# EAGLE schematic 320349C(Rev1)E7 (EAGLE 7.7.0)

## Sheet 1 of 9
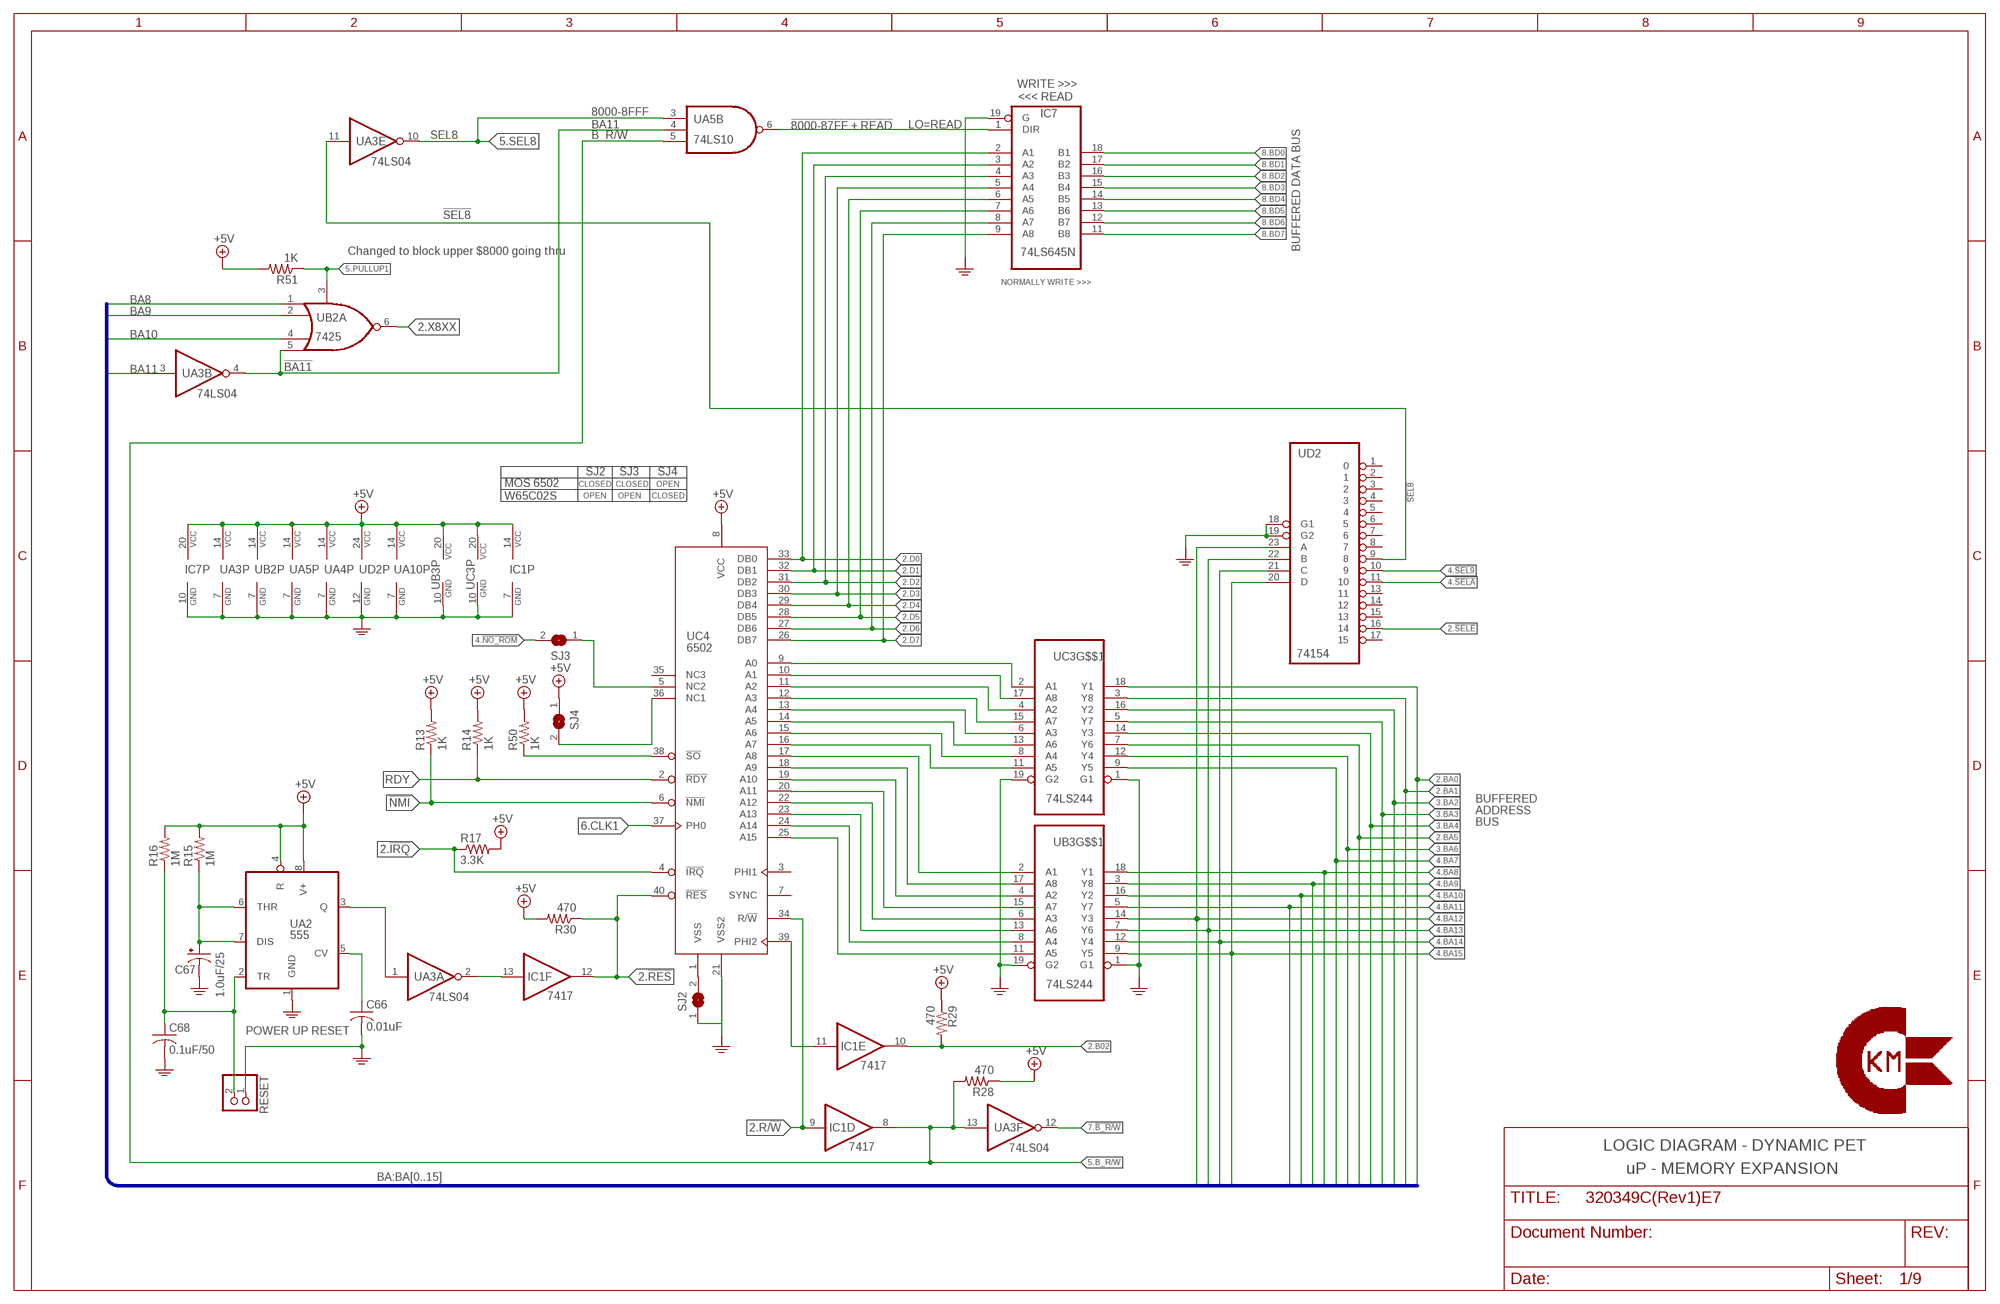
[diagram p0: schematic, sheet 1]

### Parts
C66  0.01uF  C-US025-025X050  [C025-025X050]
C67  1.0uF/25  CPOL-USE2.5-5  [E2,5-5]
C68  0.1uF/50  C-US025-025X050  [C025-025X050]
IC1  7417  7417N  [DIL14]
IC7  74LS645N  74645N  [DIL20]
R13  1K  R-US_0207/10  [0207/10]
R14  1K  R-US_0207/10  [0207/10]
R15  1M  R-US_0207/10  [0207/10]
R16  1M  R-US_0207/10  [0207/10]
R17  3.3K  R-US_0207/10  [0207/10]
R28  470  R-US_0207/10  [0207/10]
R29  470  R-US_0207/10  [0207/10]
R30  470  R-US_0207/10  [0207/10]
R50  1K  R-US_0207/10  [0207/10]
R51  1K  R-US_0207/10  [0207/10]
RESET  PINHD-1X2  [1X02]
SJ2  SJ  [SJ]
SJ3  SJ  [SJ]
SJ4  SJ  [SJ]
UA2  555  LM555N  [DIL08]
UA3  74LS04  74LS04N  [DIL14]
UA4  74LS00  74LS00N  [DIL14]
UA5  74LS10  74LS10N  [DIL14]
UA10  7417  7417N  [DIL14]
UB2  7425  7425N  [DIL14]
UB3  74LS244  74LS244B  [DIL20]
UC3  74LS244  74LS244B  [DIL20]
UC4  6502  [DIP40]
UD2  74154  74154N  [DIL24-6]

### Nets
!B_R/W: UA3.12(F:O) ; also sheet 7
!BA11: UA3.4(B:O) UA5.4(B:I1) UB2.5(A:I3) ; also sheet 7
!IRQ: R17.1 UC4.4(!IRQ) ; also sheet 2,3
!NMI: R13.1 UC4.6(!NMI)
!NO_ROM: SJ3.2 ; also sheet 4
!RES: IC1.12(F:O) R30.1 UC4.40(!RES) ; also sheet 2,3
!SEL8: UA3.11(E:I) UD2.9 ; also sheet 4
!SEL9: UD2.10 ; also sheet 4,5
!SELA: UD2.11 ; also sheet 4,5
!SELE: UD2.16 ; also sheet 2,3,4
+5V: IC1.14(P:VCC) IC7.20(VCC) R13.2 R14.2 R15.2 R16.2 R17.2 R28.1 R29.1 R30.2 R50.2 R51.2 SJ4.1 UA2.4(R) UA2.8(V+) UA3.14(P:VCC) UA4.14(P:VCC) UA5.14(P:VCC) UA10.14(P:VCC) UB2.14(P:VCC) UB3.20(VCC) UC3.20(VCC) UC4.8(VCC) UD2.24(VCC) ; also sheet 2,3,4,5,6,7,8,9
AB0: UC3.2(A1) UC4.9(A0)
AB1: UC3.17(A8) UC4.10(A1)
AB2: UC3.4(A2) UC4.11(A2)
AB3: UC3.15(A7) UC4.12(A3)
AB4: UC3.6(A3) UC4.13(A4)
AB5: UC3.13(A6) UC4.14(A5)
AB6: UC3.8(A4) UC4.15(A6)
AB7: UC3.11(A5) UC4.16(A7)
AB8: UB3.2(A1) UC4.17(A8)
AB9: UB3.17(A8) UC4.18(A9)
AB10: UB3.4(A2) UC4.19(A10)
AB11: UB3.15(A7) UC4.20(A11)
AB12: UB3.6(A3) UC4.22(A12)
AB13: UB3.13(A6) UC4.23(A13)
AB14: UB3.8(A4) UC4.24(A14)
AB15: UB3.11(A5) UC4.25(A15)
B02: IC1.10(E:O) R29.2 ; also sheet 2,3,5,7
B_R/W: IC1.8(D:O) R28.2 UA3.13(F:I) UA5.5(B:I2) ; also sheet 5,7
BA0: UC3.18(Y1) ; also sheet 2,3,4,5,7
BA1: UC3.3(Y8) ; also sheet 2,3,4,5,7
BA2: UC3.16(Y2) ; also sheet 3,4,5,7
BA3: UC3.5(Y7) ; also sheet 3,4,5,7
BA4: UC3.14(Y3) ; also sheet 3,4,5,7
BA5: UC3.7(Y6) ; also sheet 2,4,5,7
BA6: UC3.12(Y4) ; also sheet 3,4,5,7
BA7: UC3.9(Y5) ; also sheet 4,5,7
BA8: UB2.1(A:I0) UB3.18(Y1) ; also sheet 4,5,7
BA9: UB2.2(A:I1) UB3.3(Y8) ; also sheet 4,5,7
BA10: UB2.4(A:I2) UB3.16(Y2) ; also sheet 4,5,7
BA11: UA3.3(B:I) UB3.5(Y7) ; also sheet 4,5
BA12: UB3.14(Y3) UD2.23(A) ; also sheet 4,5
BA13: UB3.7(Y6) UD2.22(B) ; also sheet 4,5
BA14: UB3.12(Y4) UD2.21(C) ; also sheet 4,5
BA15: UB3.9(Y5) UD2.20(D) ; also sheet 4,5
BD0: IC7.18(B1) ; also sheet 8
BD1: IC7.17(B2) ; also sheet 8
BD2: IC7.16(B3) ; also sheet 8
BD3: IC7.15(B4) ; also sheet 8
BD4: IC7.14(B5) ; also sheet 8
BD5: IC7.13(B6) ; also sheet 8
BD6: IC7.12(B7) ; also sheet 8
BD7: IC7.11(B8) ; also sheet 8
CLK1: UC4.37(PH0) ; also sheet 6,7
CLK2: IC1.11(E:I) UC4.39(PHI2)
D0: IC7.2(A1) UC4.33(DB0) ; also sheet 2,3,4,5
D1: IC7.3(A2) UC4.32(DB1) ; also sheet 2,3,4,5
D2: IC7.4(A3) UC4.31(DB2) ; also sheet 2,3,4,5
D3: IC7.5(A4) UC4.30(DB3) ; also sheet 2,3,4,5
D4: IC7.6(A5) UC4.29(DB4) ; also sheet 2,3,4,5
D5: IC7.7(A6) UC4.28(DB5) ; also sheet 2,3,4,5
D6: IC7.8(A7) UC4.27(DB6) ; also sheet 2,3,4,5
D7: IC7.9(A8) UC4.26(DB7) ; also sheet 2,3,4,5
GND: C66.2 C67.- C68.2 IC1.7(P:GND) IC7.10(GND) IC7.19(G) RESET.1 SJ2.1 UA2.1(GND) UA3.7(P:GND) UA4.7(P:GND) UA5.7(P:GND) UA10.7(P:GND) UB2.7(P:GND) UB3.1(G1) UB3.10(GND) UB3.19(G2) UC3.1(G1) UC3.10(GND) UC3.19(G2) UC4.21(VSS2) UD2.12(GND) UD2.18(G1) UD2.19(G2) ; also sheet 2,3,4,5,6,7,8,9
N$28: IC7.1(DIR) UA5.6(B:O)
N$32: R50.1 UC4.38(!SO)
N$33: C66.1 UA2.5(CV)
N$35: C67.+ R15.1 UA2.6(THR) UA2.7(DIS)
N$36: C68.1 R16.1 RESET.2 UA2.2(TR)
N$39: IC1.13(F:I) UA3.2(A:O)
N$40: UA2.3(Q) UA3.1(A:I)
N$85: SJ3.1 UC4.5(NC2)
N$91: SJ4.2 UC4.36(NC1)
N$95: SJ2.2 UC4.1(VSS)
PULLUP1: R51.1 UB2.3(A:G) ; also sheet 5
R/!W: IC1.9(D:I) UC4.34(R/!W) ; also sheet 2,3
RDY: R14.1 UC4.2(!RDY)
SEL8: UA3.10(E:O) UA5.3(B:I0) ; also sheet 5,7
X8XX: UB2.6(A:O) ; also sheet 2,3,4
Unconnected: UC4.3(PHI1) UC4.7(SYNC) UC4.35(NC3) UD2.1 UD2.2 UD2.3 UD2.4 UD2.5 UD2.6 UD2.7 UD2.8 UD2.13 UD2.14 UD2.15 UD2.17

### Buses
BA:BA[0..15]

### Notes on the sheet
- WRITE >>>
- <<< READ
- 8000-8FFF
- !8000-87FF + READ | LO=READ
- BUFFERED DATA BUS
- Changed to block upper $8000 going thru
- NORMALLY WRITE >>>
- SJ2 | SJ3 | SJ4
- MOS 6502 | CLOSED | CLOSED | OPEN
- W65C02S | OPEN | OPEN | CLOSED
- BUFFERED
- ADDRESS
- BUS
- POWER UP RESET
- LOGIC DIAGRAM - DYNAMIC PET
- uP - MEMORY EXPANSION

## Sheet 2 of 9
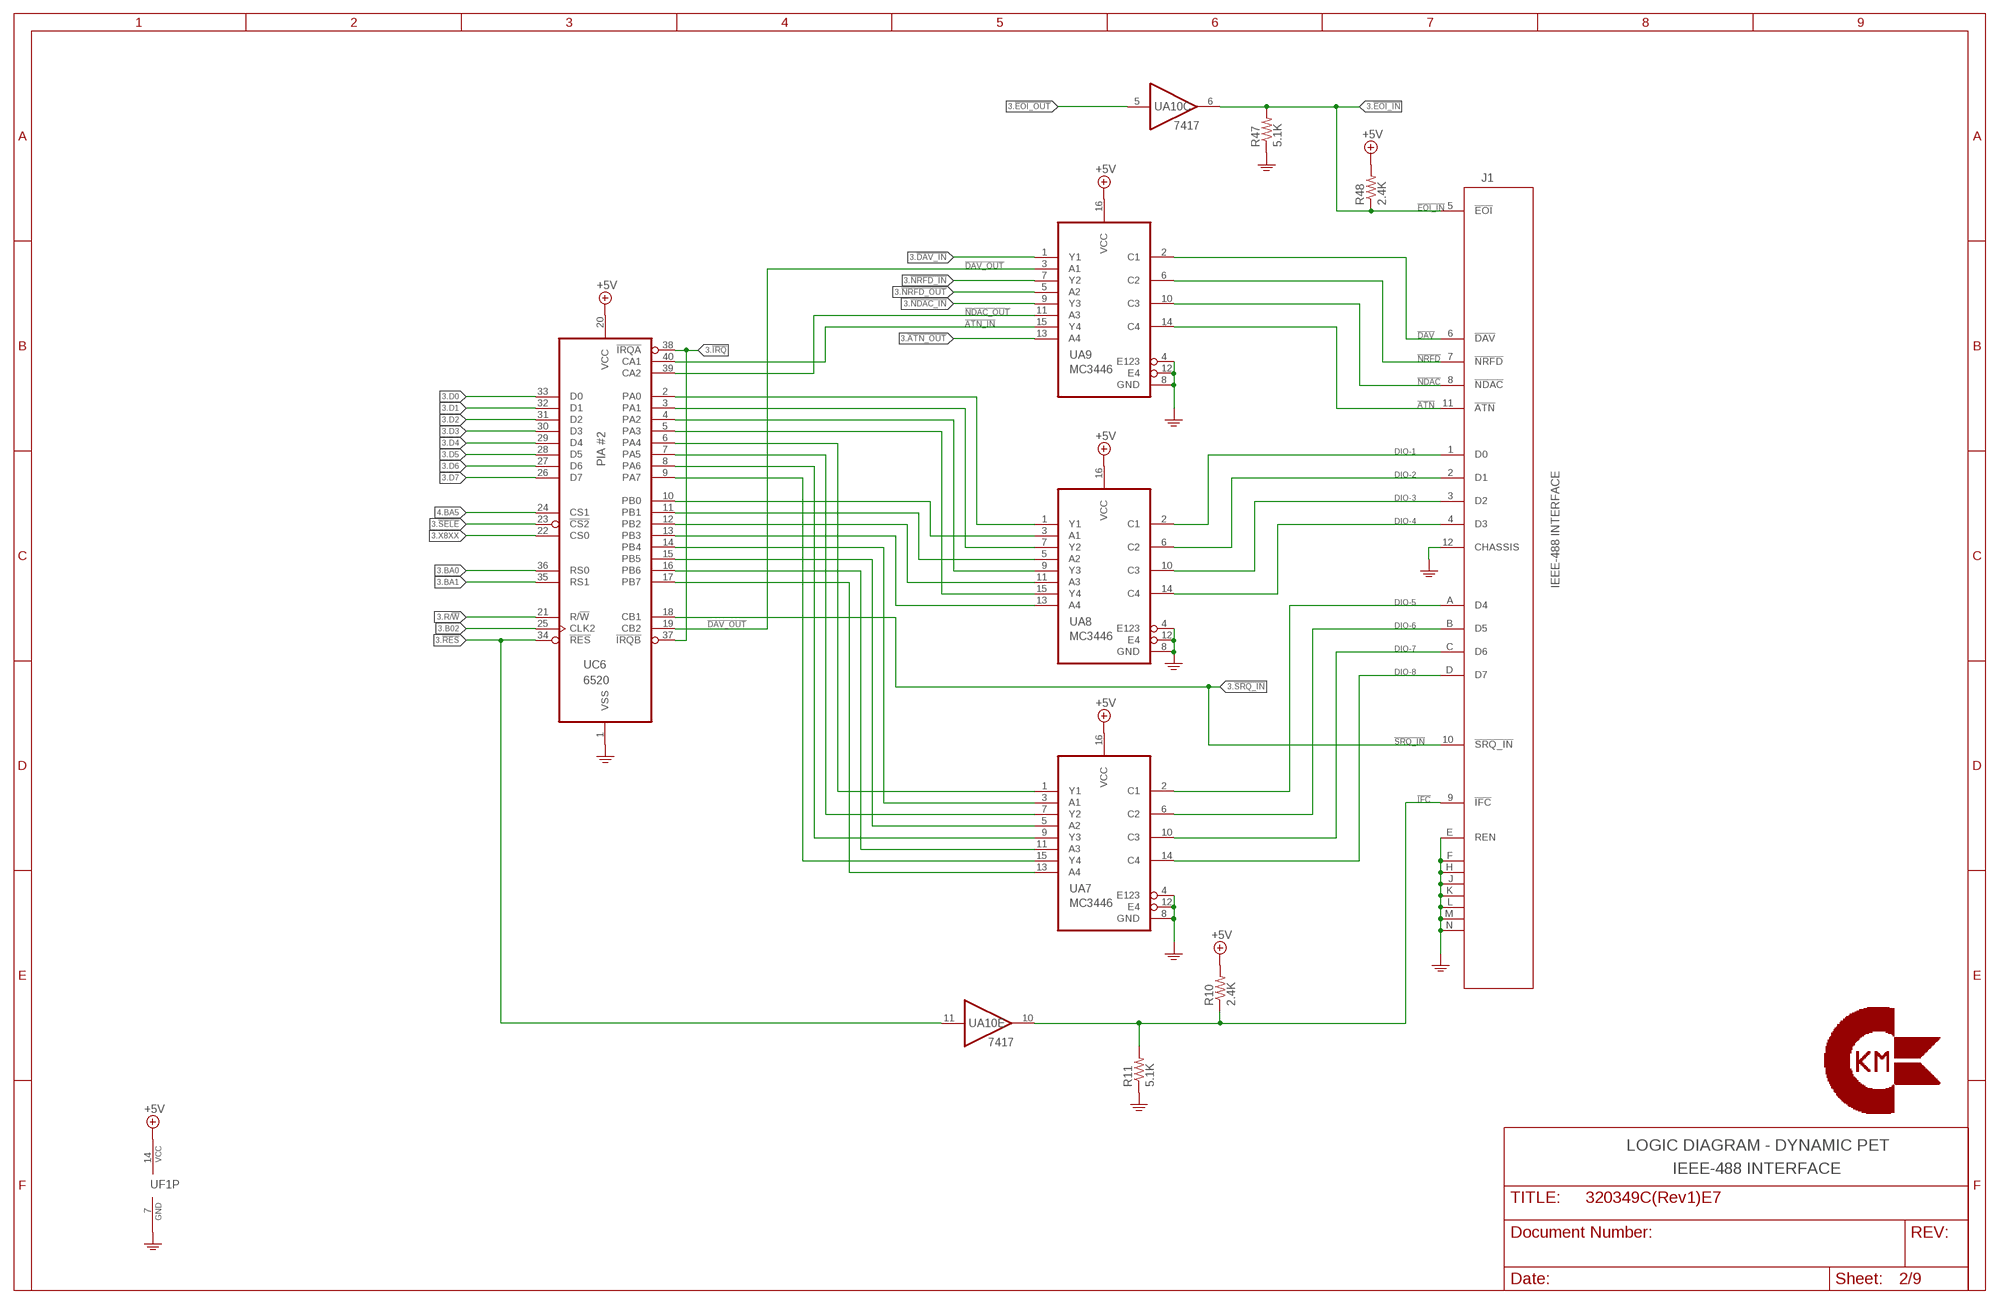
[diagram p1: schematic, sheet 2]

### Parts
J1  IEEE-488 INTERFACE  IEEE-EDGE  [UPS24EDGE]
R10  2.4K  R-US_0207/10  [0207/10]
R11  5.1K  R-US_0207/10  [0207/10]
R47  5.1K  R-US_0207/10  [0207/10]
R48  2.4K  R-US_0207/10  [0207/10]
U$32  CBM-XL  [CBM-XL]
UA7  MC3446  MC3446N  [DIL16]
UA8  MC3446  MC3446N  [DIL16]
UA9  MC3446  MC3446N  [DIL16]
UC6  6520  [DIL40]
UF1  74LS08  74LS08N  [DIL14]

### Nets
!ATN: J1.11(!ATN) UA9.14(C4)
!ATN_IN: UA9.15(Y4) UC6.40(CA1)
!ATN_OUT: UA9.13(A4) ; also sheet 3
!DAV: J1.6(!DAV) UA9.2(C1)
!DAV_IN: UA9.1(Y1) ; also sheet 3
!DAV_OUT: UA9.3(A1) UC6.19(CB2)
!EOI_IN: J1.5(!EOI) R47.2 R48.1 UA10.6(C:O) ; also sheet 3
!EOI_OUT: UA10.5(C:I) ; also sheet 3
!IFC: J1.9(!IFC) R10.1 R11.2 UA10.10(E:O)
!IRQ: UC6.37(!IRQB) UC6.38(!IRQA) ; also sheet 1,3
!NDAC: J1.8(!NDAC) UA9.10(C3)
!NDAC_IN: UA9.9(Y3) ; also sheet 3
!NDAC_OUT: UA9.11(A3) UC6.39(CA2)
!NRFD: J1.7(!NRFD) UA9.6(C2)
!NRFD_IN: UA9.7(Y2) ; also sheet 3
!NRFD_OUT: UA9.5(A2) ; also sheet 3
!RES: UA10.11(E:I) UC6.34(!RES) ; also sheet 1,3
!SELE: UC6.23(!CS2) ; also sheet 1,3,4
!SRQ_IN: J1.10(!SRQ_IN) UC6.18(CB1) ; also sheet 3
+5V: R10.2 R48.2 UA7.16(VCC) UA8.16(VCC) UA9.16(VCC) UC6.20(VCC) UF1.14(P:VCC) ; also sheet 1,3,4,5,6,7,8,9
B02: UC6.25(CLK2) ; also sheet 1,3,5,7
BA0: UC6.36(RS0) ; also sheet 1,3,4,5,7
BA1: UC6.35(RS1) ; also sheet 1,3,4,5,7
BA5: UC6.24(CS1) ; also sheet 1,4,5,7
D0: UC6.33(D0) ; also sheet 1,3,4,5
D1: UC6.32(D1) ; also sheet 1,3,4,5
D2: UC6.31(D2) ; also sheet 1,3,4,5
D3: UC6.30(D3) ; also sheet 1,3,4,5
D4: UC6.29(D4) ; also sheet 1,3,4,5
D5: UC6.28(D5) ; also sheet 1,3,4,5
D6: UC6.27(D6) ; also sheet 1,3,4,5
D7: UC6.26(D7) ; also sheet 1,3,4,5
DI-1: UA8.1(Y1) UC6.2(PA0)
DI-2: UA8.7(Y2) UC6.3(PA1)
DI-3: UA8.9(Y3) UC6.4(PA2)
DI-4: UA8.15(Y4) UC6.5(PA3)
DI-5: UA7.1(Y1) UC6.6(PA4)
DI-6: UA7.7(Y2) UC6.7(PA5)
DI-7: UA7.9(Y3) UC6.8(PA6)
DI-8: UA7.15(Y4) UC6.9(PA7)
DIO-1: J1.1(D0) UA8.2(C1)
DIO-2: J1.2(D1) UA8.6(C2)
DIO-3: J1.3(D2) UA8.10(C3)
DIO-4: J1.4(D3) UA8.14(C4)
DIO-5: J1.A(D4) UA7.2(C1)
DIO-6: J1.B(D5) UA7.6(C2)
DIO-7: J1.C(D6) UA7.10(C3)
DIO-8: J1.D(D7) UA7.14(C4)
DO-1: UA8.3(A1) UC6.10(PB0)
DO-2: UA8.5(A2) UC6.11(PB1)
DO-3: UA8.11(A3) UC6.12(PB2)
DO-4: UA8.13(A4) UC6.13(PB3)
DO-5: UA7.3(A1) UC6.14(PB4)
DO-6: UA7.5(A2) UC6.15(PB5)
DO-7: UA7.11(A3) UC6.16(PB6)
DO-8: UA7.13(A4) UC6.17(PB7)
GND: J1.12(CHASSIS) J1.E(REN) J1.F J1.H J1.J J1.K J1.L J1.M J1.N R11.1 R47.1 UA7.4(E123) UA7.8(GND) UA7.12(E4) UA8.4(E123) UA8.8(GND) UA8.12(E4) UA9.4(E123) UA9.8(GND) UA9.12(E4) UC6.1(VSS) UF1.7(P:GND) ; also sheet 1,3,4,5,6,7,8,9
R/!W: UC6.21(R/!W) ; also sheet 1,3
X8XX: UC6.22(CS0) ; also sheet 1,3,4

### Notes on the sheet
- PIA #2
- LOGIC DIAGRAM - DYNAMIC PET
- IEEE-488 INTERFACE

## Sheet 3 of 9
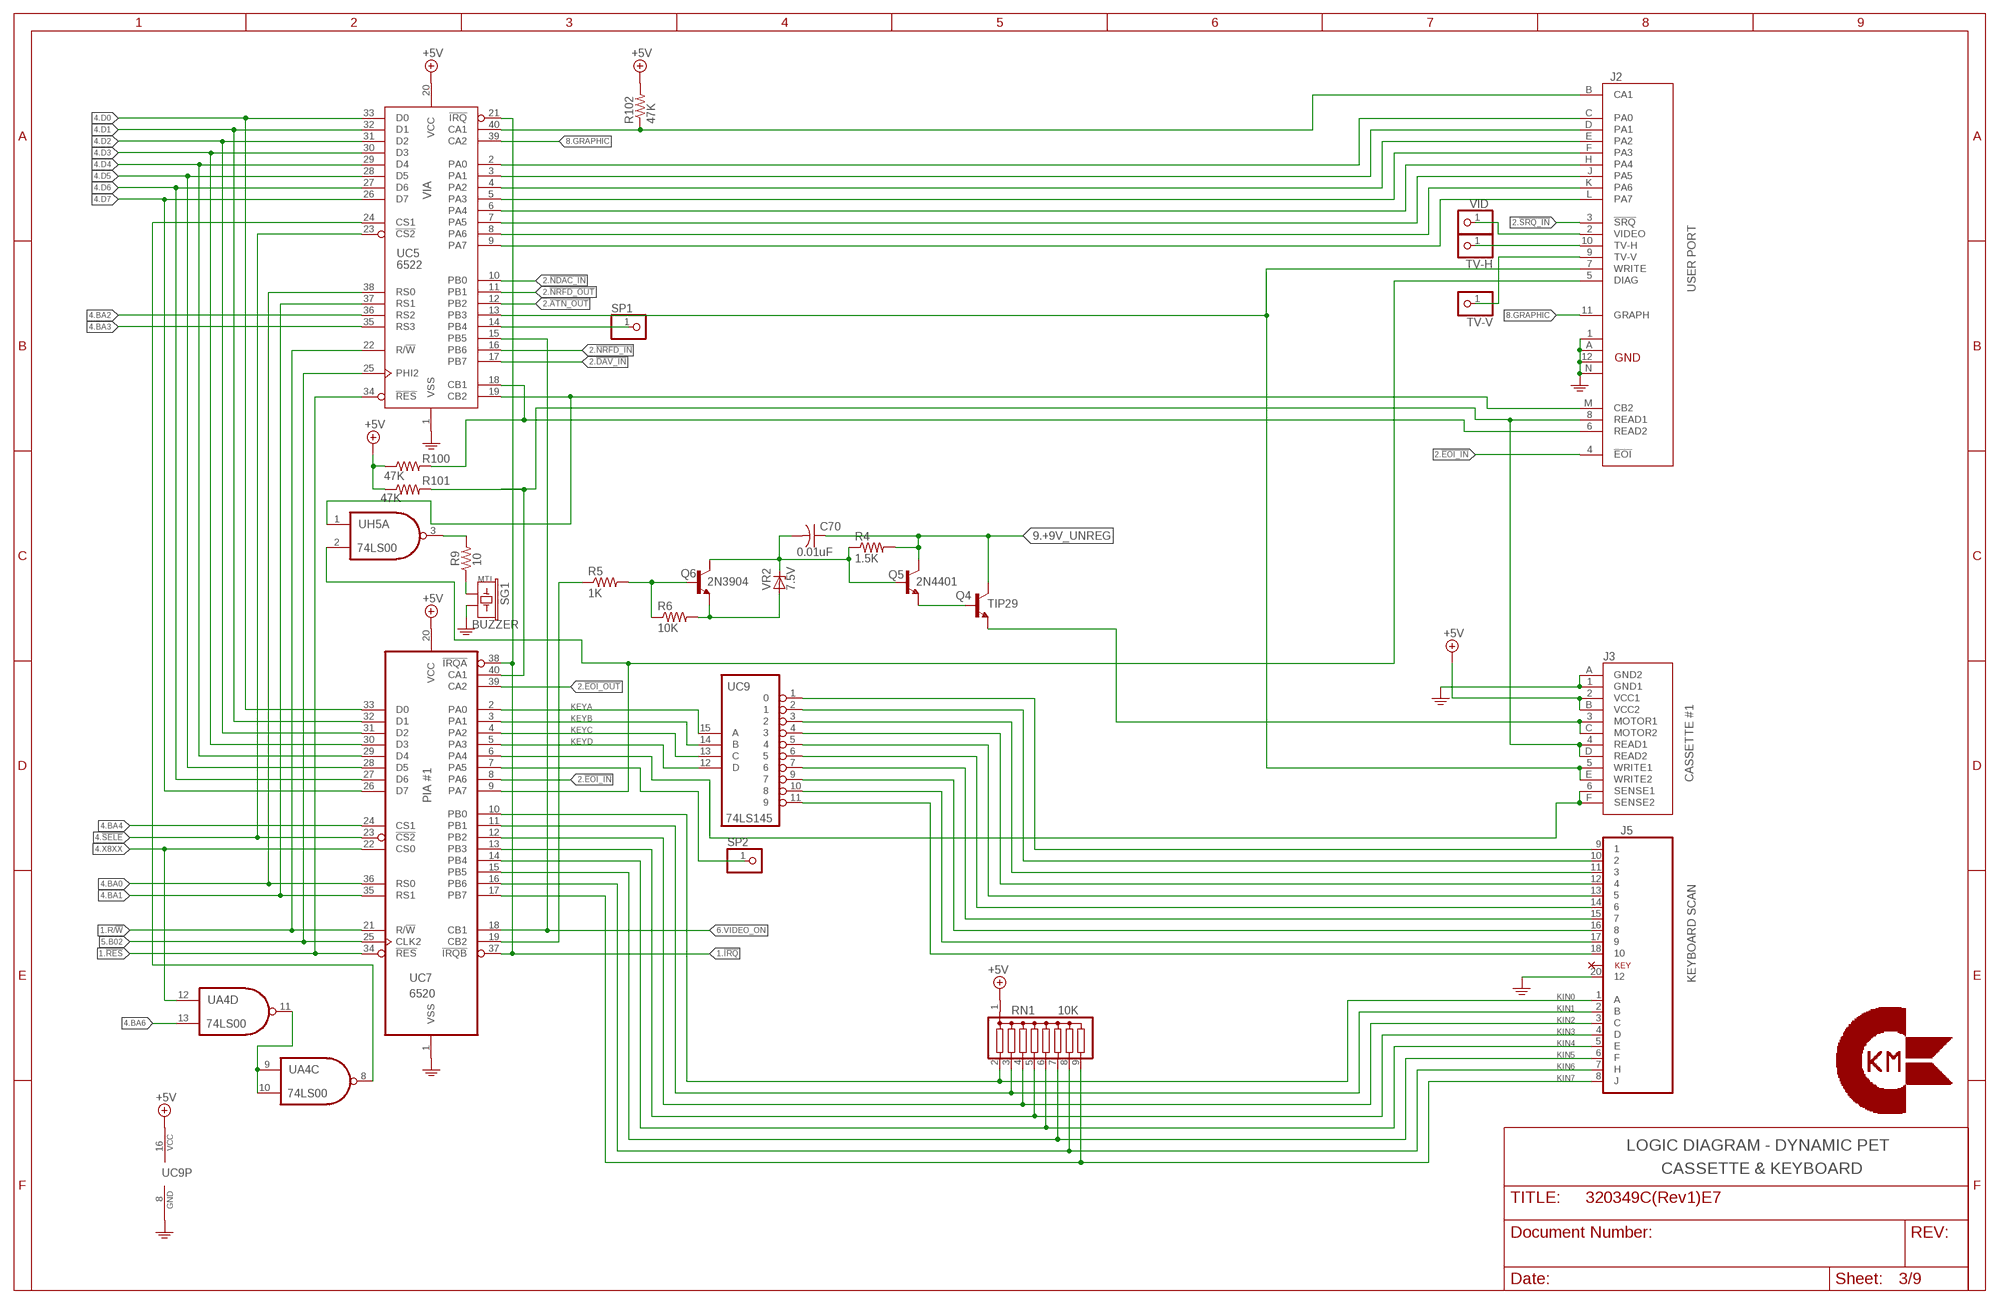
[diagram p2: schematic, sheet 3]

### Parts
C70  0.01uF  C-US025-025X050  [C025-025X050]
J2  USER PORT  CBM_USERPORT-EDGE  [UPS24EDGE]
J3  CASSETTE #1  CASETTE_EDGE  [CASSETTE]
J5  KEYBOARD SCAN  PET_KEYBOARD  [PET_KEYBOARD]
Q4  TIP29  [TO220]
Q5  2N4401  [TO92]
Q6  2N3904  [TO92]
R4  1.5K  R-US_0207/10  [0207/10]
R5  1K  R-US_0207/10  [0207/10]
R6  10K  R-US_0207/10  [0207/10]
R9  10  R-US_0207/10  [0207/10]
R100  47K  R-US_0207/10  [0207/10]
R101  47K  R-US_0207/10  [0207/10]
R102  47K  R-US_0207/10  [0207/10]
RN1  10K  G08R  [SIL9]
SG1  BUZZER  BUZZERPTH  [BUZZER-12MM]
SP1  PINHD-1X1  [1X01]
SP2  PINHD-1X1  [1X01]
TV-H  PINHD-1X1  [1X01]
TV-V  PINHD-1X1  [1X01]
UC5  6522  [DIP40]
UC7  6520  [DIL40]
UC9  74LS145  74LS145N  [DIL16]
UH5  74LS00  74LS00N  [DIL14]
VID  PINHD-1X1  [1X01]
VR2  7.5V  ZPY  [DO41Z10]

### Nets
!ATN_OUT: UC5.12(PB2) ; also sheet 2
!DAV_IN: UC5.17(PB7) ; also sheet 2
!EOI_IN: J2.4(!EOI) UC7.8(PA6) ; also sheet 2
!EOI_OUT: UC7.39(CA2) ; also sheet 2
!IRQ: UC5.21(!IRQ) UC7.37(!IRQB) UC7.38(!IRQA) ; also sheet 1,2
!NDAC_IN: UC5.10(PB0) ; also sheet 2
!NRFD_IN: UC5.16(PB6) ; also sheet 2
!NRFD_OUT: UC5.11(PB1) ; also sheet 2
!RES: UC5.34(!RES) UC7.34(!RES) ; also sheet 1,2
!SELE: UC5.23(!CS2) UC7.23(!CS2) ; also sheet 1,2,4
!SRQ_IN: J2.3(!SRQ) ; also sheet 2
#1_CASS_MOTOR: J3.3(MOTOR1) J3.C(MOTOR2) Q4.3(E)
#1_CASS_READ: J2.8(READ1) J3.4(READ1) J3.D(READ2) R101.2 UC7.40(CA1)
#1_CASS_SWITCH: J3.6(SENSE1) J3.F(SENSE2) UC7.6(PA4)
#2_CASS_READ: J2.6(READ2) R100.2 UC5.18(CB1)
#2_CASS_SWITCH: SP2.1 UC7.7(PA5)
+5V: J3.2(VCC1) J3.B(VCC2) R100.1 R101.1 R102.2 RN1.1 UC5.20(VCC) UC7.20(VCC) UC9.16(VCC) ; also sheet 1,2,4,5,6,7,8,9
+9V_UNREG: C70.1 Q4.2(C) Q5.1(C) R4.2 ; also sheet 9
B02: UC5.25(PHI2) UC7.25(CLK2) ; also sheet 1,2,5,7
BA0: UC5.38(RS0) UC7.36(RS0) ; also sheet 1,2,4,5,7
BA1: UC5.37(RS1) UC7.35(RS1) ; also sheet 1,2,4,5,7
BA2: UC5.36(RS2) ; also sheet 1,4,5,7
BA3: UC5.35(RS3) ; also sheet 1,4,5,7
BA4: UC7.24(CS1) ; also sheet 1,4,5,7
BA6: UA4.13(D:I1) ; also sheet 1,4,5,7
CA1: J2.B(CA1) R102.1 UC5.40(CA1)
CASS_WRITE: J2.7(WRITE) J3.5(WRITE1) J3.E(WRITE2) UC5.13(PB3)
CB2: J2.M(CB2) UC5.19(CB2) UH5.1(A:I0)
CS1: UA4.8(C:O) UC5.24(CS1)
D0: UC5.33(D0) UC7.33(D0) ; also sheet 1,2,4,5
D1: UC5.32(D1) UC7.32(D1) ; also sheet 1,2,4,5
D2: UC5.31(D2) UC7.31(D2) ; also sheet 1,2,4,5
D3: UC5.30(D3) UC7.30(D3) ; also sheet 1,2,4,5
D4: UC5.29(D4) UC7.29(D4) ; also sheet 1,2,4,5
D5: UC5.28(D5) UC7.28(D5) ; also sheet 1,2,4,5
D6: UC5.27(D6) UC7.27(D6) ; also sheet 1,2,4,5
D7: UC5.26(D7) UC7.26(D7) ; also sheet 1,2,4,5
DIAG: J2.5(DIAG) UC7.9(PA7) UH5.2(A:I1)
GND: J2.1(GND1) J2.12(GND3) J2.A(GND2) J2.N(GND4) J3.1(GND1) J3.A(GND2) J5.20 SG1.- UC5.1(VSS) UC7.1(VSS) UC9.8(GND) ; also sheet 1,2,4,5,6,7,8,9
GRAPHIC: J2.11(GRAPH) UC5.39(CA2) ; also sheet 8
KEYA: UC7.2(PA0) UC9.15(A)
KEYB: UC7.3(PA1) UC9.14(B)
KEYC: UC7.4(PA2) UC9.13(C)
KEYD: UC7.5(PA3) UC9.12(D)
KIN0: J5.1(A) RN1.2 UC7.10(PB0)
KIN1: J5.2(B) RN1.3 UC7.11(PB1)
KIN2: J5.3(C) RN1.4 UC7.12(PB2)
KIN3: J5.4(D) RN1.5 UC7.13(PB3)
KIN4: J5.5(E) RN1.6 UC7.14(PB4)
KIN5: J5.6(F) RN1.7 UC7.15(PB5)
KIN6: J5.7(H) RN1.8 UC7.16(PB6)
KIN7: J5.8(J) RN1.9 UC7.17(PB7)
N$14: R9.2 UH5.3(A:O)
N$15: R9.1 SG1.+
N$47: J2.2(VIDEO) VID.1
N$48: J2.10(TV-H) TV-H.1
N$50: J2.9(TV-V) TV-V.1
N$51: UA4.9(C:I0) UA4.10(C:I1) UA4.11(D:O)
N$89: SP1.1 UC5.14(PB4)
N$92: Q6.2(B) R5.2 R6.1
N$93: Q6.3(E) R6.2 VR2.A
N$94: C70.2 Q5.2(B) Q6.1(C) R4.1 VR2.C
N$98: Q4.1(B) Q5.3(E)
N$103: R5.1 UC7.19(CB2)
N$114: J5.18 UC9.11
N$115: J5.17 UC9.10
N$116: J5.16 UC9.9
N$117: J5.15 UC9.7
N$118: J5.14 UC9.6
N$119: J5.13 UC9.5
N$120: J5.12 UC9.4
N$121: J5.11 UC9.3
N$122: J5.10 UC9.2
N$123: J5.9 UC9.1
PA0: J2.C(PA0) UC5.2(PA0)
PA1: J2.D(PA1) UC5.3(PA1)
PA2: J2.E(PA2) UC5.4(PA2)
PA3: J2.F(PA3) UC5.5(PA3)
PA4: J2.H(PA4) UC5.6(PA4)
PA5: J2.J(PA5) UC5.7(PA5)
PA6: J2.K(PA6) UC5.8(PA6)
PA7: J2.L(PA7) UC5.9(PA7)
R/!W: UC5.22(R/!W) UC7.21(R/!W) ; also sheet 1,2
VIDEO_ON: UC5.15(PB5) UC7.18(CB1) ; also sheet 6,7,8
X8XX: UA4.12(D:I0) UC7.22(CS0) ; also sheet 1,2,4

### Notes on the sheet
- VIA
- MTI
- PIA #1
- LOGIC DIAGRAM - DYNAMIC PET
- CASSETTE & KEYBOARD

## Sheet 4 of 9
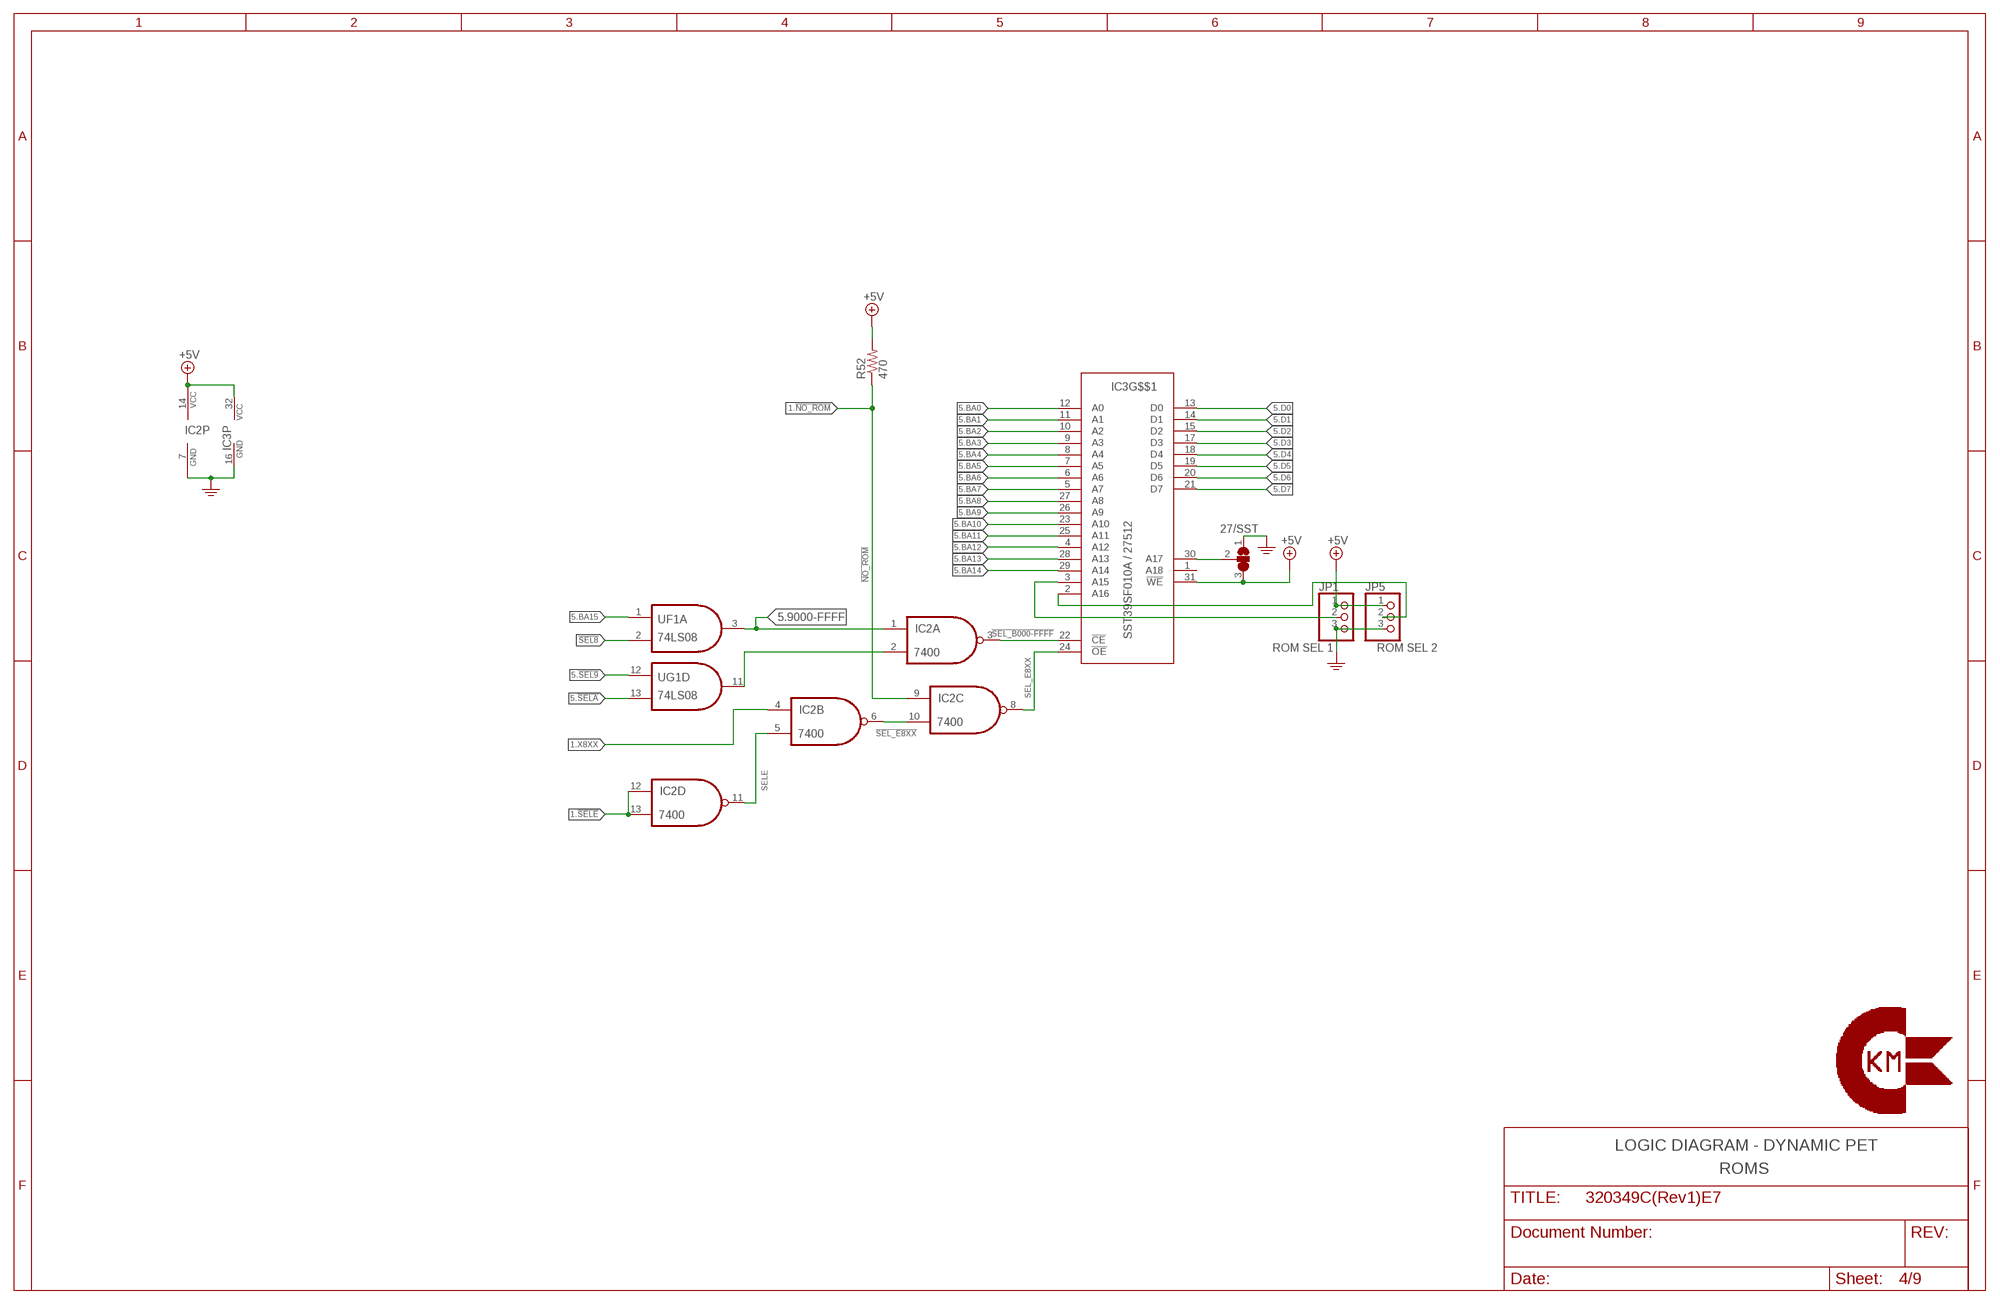
[diagram p3: schematic, sheet 4]

### Parts
27/SST  27/SST  SJ2W  [SJ_2]
IC2  7400  7400N  [DIL14]
IC3  SST39SF010A / 27512  SST39SF010A  [SST39SF010A]
JP1  ROM SEL 1  PINHD-1X3  [1X03]
JP5  ROM SEL 2  PINHD-1X3  [1X03]
R52  470  R-US_0207/10  [0207/10]
UG1  74LS08  74LS08N  [DIL14]

### Nets
9000-FFFF: IC2.1(A:I0) UF1.3(A:O) ; also sheet 5
!NO_ROM: IC2.9(C:I0) R52.1 ; also sheet 1
!SEL8: UF1.2(A:I1) ; also sheet 1
!SEL9: UG1.12(D:I0) ; also sheet 1,5
!SEL_B000-FFFF: IC2.3(A:O) IC3.22(G$$1:!CE)
!SEL_E8XX: IC2.6(B:O) IC2.10(C:I1) ; also sheet 5
!SELA: UG1.13(D:I1) ; also sheet 1,5
!SELE: IC2.12(D:I0) IC2.13(D:I1) ; also sheet 1,2,3
+5V: 27/SST.3 IC2.14(P:VCC) IC3.31(G$$1:!WE) IC3.32(P:VCC) JP1.1 JP5.1 R52.2 ; also sheet 1,2,3,5,6,7,8,9
BA0: IC3.12(G$$1:A0) ; also sheet 1,2,3,5,7
BA1: IC3.11(G$$1:A1) ; also sheet 1,2,3,5,7
BA2: IC3.10(G$$1:A2) ; also sheet 1,3,5,7
BA3: IC3.9(G$$1:A3) ; also sheet 1,3,5,7
BA4: IC3.8(G$$1:A4) ; also sheet 1,3,5,7
BA5: IC3.7(G$$1:A5) ; also sheet 1,2,5,7
BA6: IC3.6(G$$1:A6) ; also sheet 1,3,5,7
BA7: IC3.5(G$$1:A7) ; also sheet 1,5,7
BA8: IC3.27(G$$1:A8) ; also sheet 1,5,7
BA9: IC3.26(G$$1:A9) ; also sheet 1,5,7
BA10: IC3.23(G$$1:A10) ; also sheet 1,5,7
BA11: IC3.25(G$$1:A11) ; also sheet 1,5
BA12: IC3.4(G$$1:A12) ; also sheet 1,5
BA13: IC3.28(G$$1:A13) ; also sheet 1,5
BA14: IC3.29(G$$1:A14) ; also sheet 1,5
BA15: UF1.1(A:I0) ; also sheet 1,5
D0: IC3.13(G$$1:D0) ; also sheet 1,2,3,5
D1: IC3.14(G$$1:D1) ; also sheet 1,2,3,5
D2: IC3.15(G$$1:D2) ; also sheet 1,2,3,5
D3: IC3.17(G$$1:D3) ; also sheet 1,2,3,5
D4: IC3.18(G$$1:D4) ; also sheet 1,2,3,5
D5: IC3.19(G$$1:D5) ; also sheet 1,2,3,5
D6: IC3.20(G$$1:D6) ; also sheet 1,2,3,5
D7: IC3.21(G$$1:D7) ; also sheet 1,2,3,5
GND: 27/SST.1 IC2.7(P:GND) IC3.16(P:GND) JP1.3 JP5.3 ; also sheet 1,2,3,5,6,7,8,9
N$6: IC2.2(A:I1) UG1.11(D:O)
N$21: IC3.3(G$$1:A15) JP1.2
N$29: IC3.2(G$$1:A16) JP5.2
N$52: 27/SST.2 IC3.30(G$$1:A17)
SEL_E8XX: IC2.8(C:O) IC3.24(G$$1:!OE)
SELE: IC2.5(B:I1) IC2.11(D:O)
X8XX: IC2.4(B:I0) ; also sheet 1,2,3
Unconnected: IC3.1(G$$1:A18)

### Notes on the sheet
- LOGIC DIAGRAM - DYNAMIC PET
- ROMS

## Sheet 5 of 9
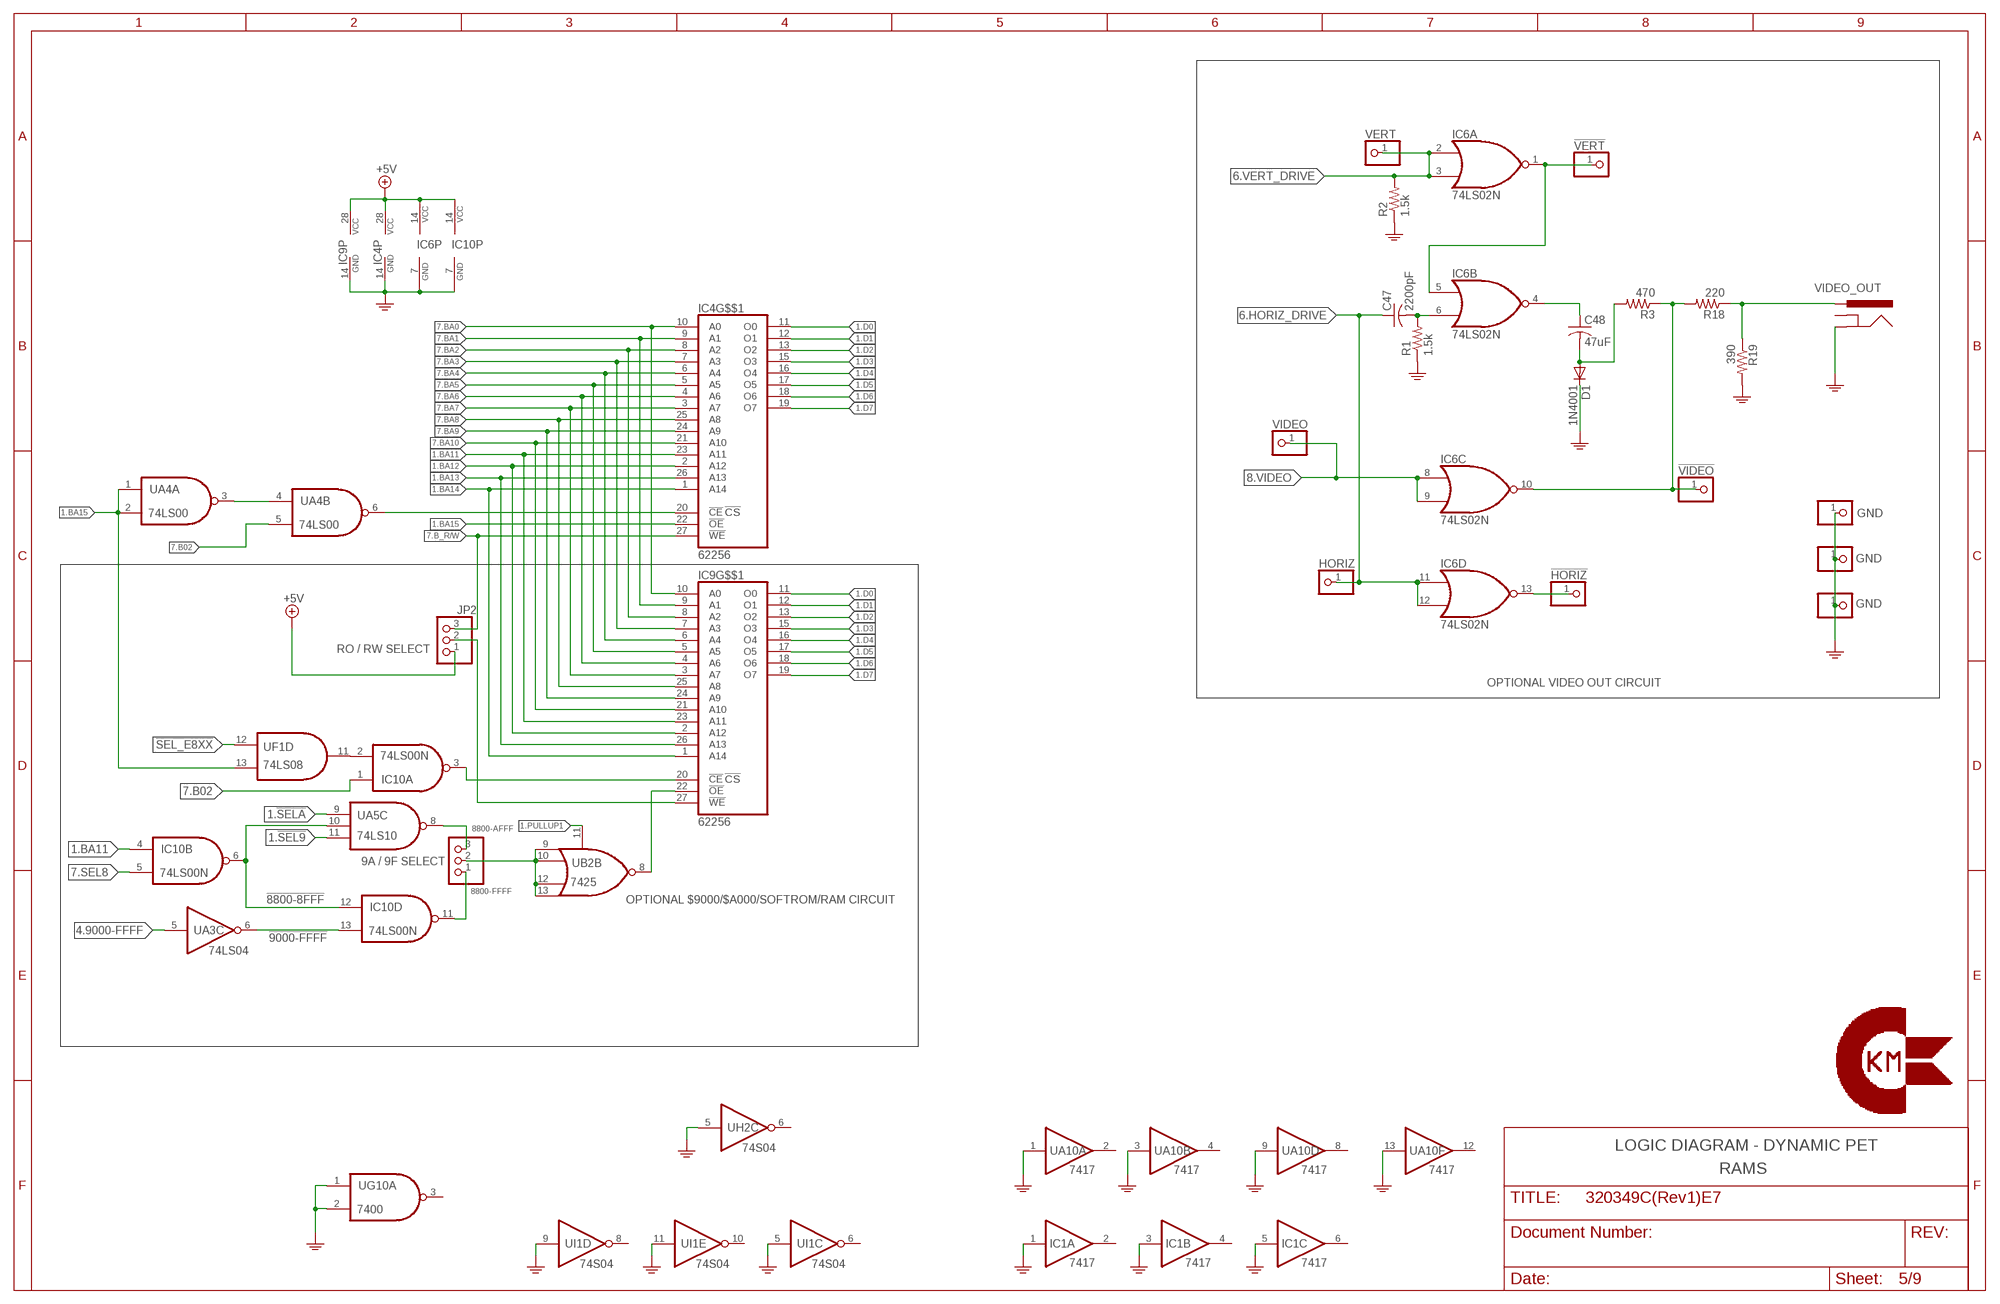
[diagram p4: schematic, sheet 5]

### Parts
!HORIZ  PINHD-1X1  [1X01]
!VERT  PINHD-1X1  [1X01]
!VIDEO  PINHD-1X1  [1X01]
C47  2200pF  C-US025-025X050  [C025-025X050]
C48  47uF  C-US050-035X075  [C050-035X075]
D1  1N4001  1N4004  [DO41-10]
HGND  GND  PINHD-1X1  [1X01]
HORIZ  PINHD-1X1  [1X01]
IC4  62256  [DIL28]
IC6  74LS02N  [DIL14]
IC9  62256  [DIL28]
IC10  74LS00N  [DIL14]
JP2  RO / RW SELECT  PINHD-1X3  [1X03]
JP3  9A / 9F SELECT  PINHD-1X3  [1X03]
R1  1.5k  R-US_0207/10  [0207/10]
R2  1.5k  R-US_0207/10  [0207/10]
R3  470  R-US_0207/10  [0207/10]
R18  220  R-US_0207/10  [0207/10]
R19  390  R-US_0207/10  [0207/10]
UG10  7400  74LS00N  [DIL14]
UH2  74S04  74S04N  [DIL14]
UI1  74S04  74LS04N  [DIL14]
VDGND  GND  PINHD-1X1  [1X01]
VERT  PINHD-1X1  [1X01]
VGND  GND  PINHD-1X1  [1X01]
VIDEO  PINHD-1X1  [1X01]
VIDEO_OUT  POWER_JACKRCA  [RCA]

### Nets
9000-FFFF: UA3.5(C:I) ; also sheet 4
!8800-8FFF: IC10.6(B:O) IC10.12(D:I0) UA5.10(C:I1)
!9000-FFFF: IC10.13(D:I1) UA3.6(C:O)
!SEL9: UA5.11(C:I2) ; also sheet 1,4
!SEL_E8XX: UF1.12(D:I0) ; also sheet 4
!SELA: UA5.9(C:I0) ; also sheet 1,4
+5V: IC4.28(P:VCC) IC6.14(P:VCC) IC9.28(P:VCC) IC10.14(P:VCC) JP2.1 ; also sheet 1,2,3,4,6,7,8,9
B02: IC10.1(A:I0) UA4.5(B:I1) ; also sheet 1,2,3,7
B_R/W: IC4.27(G$$1:!WE) JP2.3 ; also sheet 1,7
BA0: IC4.10(G$$1:A0) IC9.10(G$$1:A0) ; also sheet 1,2,3,4,7
BA1: IC4.9(G$$1:A1) IC9.9(G$$1:A1) ; also sheet 1,2,3,4,7
BA2: IC4.8(G$$1:A2) IC9.8(G$$1:A2) ; also sheet 1,3,4,7
BA3: IC4.7(G$$1:A3) IC9.7(G$$1:A3) ; also sheet 1,3,4,7
BA4: IC4.6(G$$1:A4) IC9.6(G$$1:A4) ; also sheet 1,3,4,7
BA5: IC4.5(G$$1:A5) IC9.5(G$$1:A5) ; also sheet 1,2,4,7
BA6: IC4.4(G$$1:A6) IC9.4(G$$1:A6) ; also sheet 1,3,4,7
BA7: IC4.3(G$$1:A7) IC9.3(G$$1:A7) ; also sheet 1,4,7
BA8: IC4.25(G$$1:A8) IC9.25(G$$1:A8) ; also sheet 1,4,7
BA9: IC4.24(G$$1:A9) IC9.24(G$$1:A9) ; also sheet 1,4,7
BA10: IC4.21(G$$1:A10) IC9.21(G$$1:A10) ; also sheet 1,4,7
BA11: IC4.23(G$$1:A11) IC9.23(G$$1:A11) IC10.4(B:I0) ; also sheet 1,4
BA12: IC4.2(G$$1:A12) IC9.2(G$$1:A12) ; also sheet 1,4
BA13: IC4.26(G$$1:A13) IC9.26(G$$1:A13) ; also sheet 1,4
BA14: IC4.1(G$$1:A14) IC9.1(G$$1:A14) ; also sheet 1,4
BA15: IC4.22(G$$1:!OE) UA4.1(A:I0) UA4.2(A:I1) UF1.13(D:I1) ; also sheet 1,4
D0: IC4.11(G$$1:O0) IC9.11(G$$1:O0) ; also sheet 1,2,3,4
D1: IC4.12(G$$1:O1) IC9.12(G$$1:O1) ; also sheet 1,2,3,4
D2: IC4.13(G$$1:O2) IC9.13(G$$1:O2) ; also sheet 1,2,3,4
D3: IC4.15(G$$1:O3) IC9.15(G$$1:O3) ; also sheet 1,2,3,4
D4: IC4.16(G$$1:O4) IC9.16(G$$1:O4) ; also sheet 1,2,3,4
D5: IC4.17(G$$1:O5) IC9.17(G$$1:O5) ; also sheet 1,2,3,4
D6: IC4.18(G$$1:O6) IC9.18(G$$1:O6) ; also sheet 1,2,3,4
D7: IC4.19(G$$1:O7) IC9.19(G$$1:O7) ; also sheet 1,2,3,4
GND: D1.C HGND.1 IC1.1(A:I) IC1.3(B:I) IC1.5(C:I) IC4.14(P:GND) IC6.7(P:GND) IC9.14(P:GND) IC10.7(P:GND) R1.1 R2.1 R19.2 UA10.1(A:I) UA10.3(B:I) UA10.9(D:I) UA10.13(F:I) UG10.1(A:I0) UG10.2(A:I1) UH2.5(C:I) UI1.5(C:I) UI1.9(D:I) UI1.11(E:I) VDGND.1 VGND.1 VIDEO_OUT.BARREL(GND) ; also sheet 1,2,3,4,6,7,8,9
HORIZ_DRIVE: C47.1 HORIZ.1 IC6.11(D:I0) IC6.12(D:I1) ; also sheet 6,8
N$7: JP3.3 UA5.8(C:O)
N$9: !VERT.1 IC6.1(A:O) IC6.5(B:I0)
N$10: IC10.2(A:I1) UF1.11(D:O)
N$18: R18.1 R19.1 VIDEO_OUT.BREAK(PWR)
N$26: C47.2 IC6.6(B:I1) R1.2
N$27: IC9.22(G$$1:!OE) UB2.8(B:O)
N$30: !VIDEO.1 IC6.10(C:O) R3.1 R18.2
N$31: JP3.2 UB2.9(B:I0) UB2.10(B:I1) UB2.12(B:I2) UB2.13(B:I3)
N$34: C48.1 IC6.4(B:O)
N$37: C48.2 D1.A R3.2
N$43: IC9.20(G$$1:!CE) IC10.3(A:O)
N$45: IC9.27(G$$1:!WE) JP2.2
N$74: !HORIZ.1 IC6.13(D:O)
N$76: IC4.20(G$$1:!CE) UA4.6(B:O)
N$79: IC10.11(D:O) JP3.1
N$90: UA4.3(A:O) UA4.4(B:I0)
PULLUP1: UB2.11(B:G) ; also sheet 1
SEL8: IC10.5(B:I1) ; also sheet 1,7
VERT_DRIVE: IC6.2(A:I0) IC6.3(A:I1) R2.2 VERT.1 ; also sheet 6,8
VIDEO: IC6.8(C:I0) IC6.9(C:I1) VIDEO.1 ; also sheet 8
Unconnected: IC1.2(A:O) IC1.4(B:O) IC1.6(C:O) UA10.2(A:O) UA10.4(B:O) UA10.8(D:O) UA10.12(F:O) UG10.3(A:O) UH2.6(C:O) UI1.6(C:O) UI1.8(D:O) UI1.10(E:O) VIDEO_OUT.SPRING(GNDBREAK)

### Notes on the sheet
- !CS
- OPTIONAL VIDEO OUT CIRCUIT
- !CS
- 8800-AFFF
- 8800-FFFF | OPTIONAL $9000/$A000/SOFTROM/RAM CIRCUIT
- LOGIC DIAGRAM - DYNAMIC PET
- RAMS

## Sheet 6 of 9
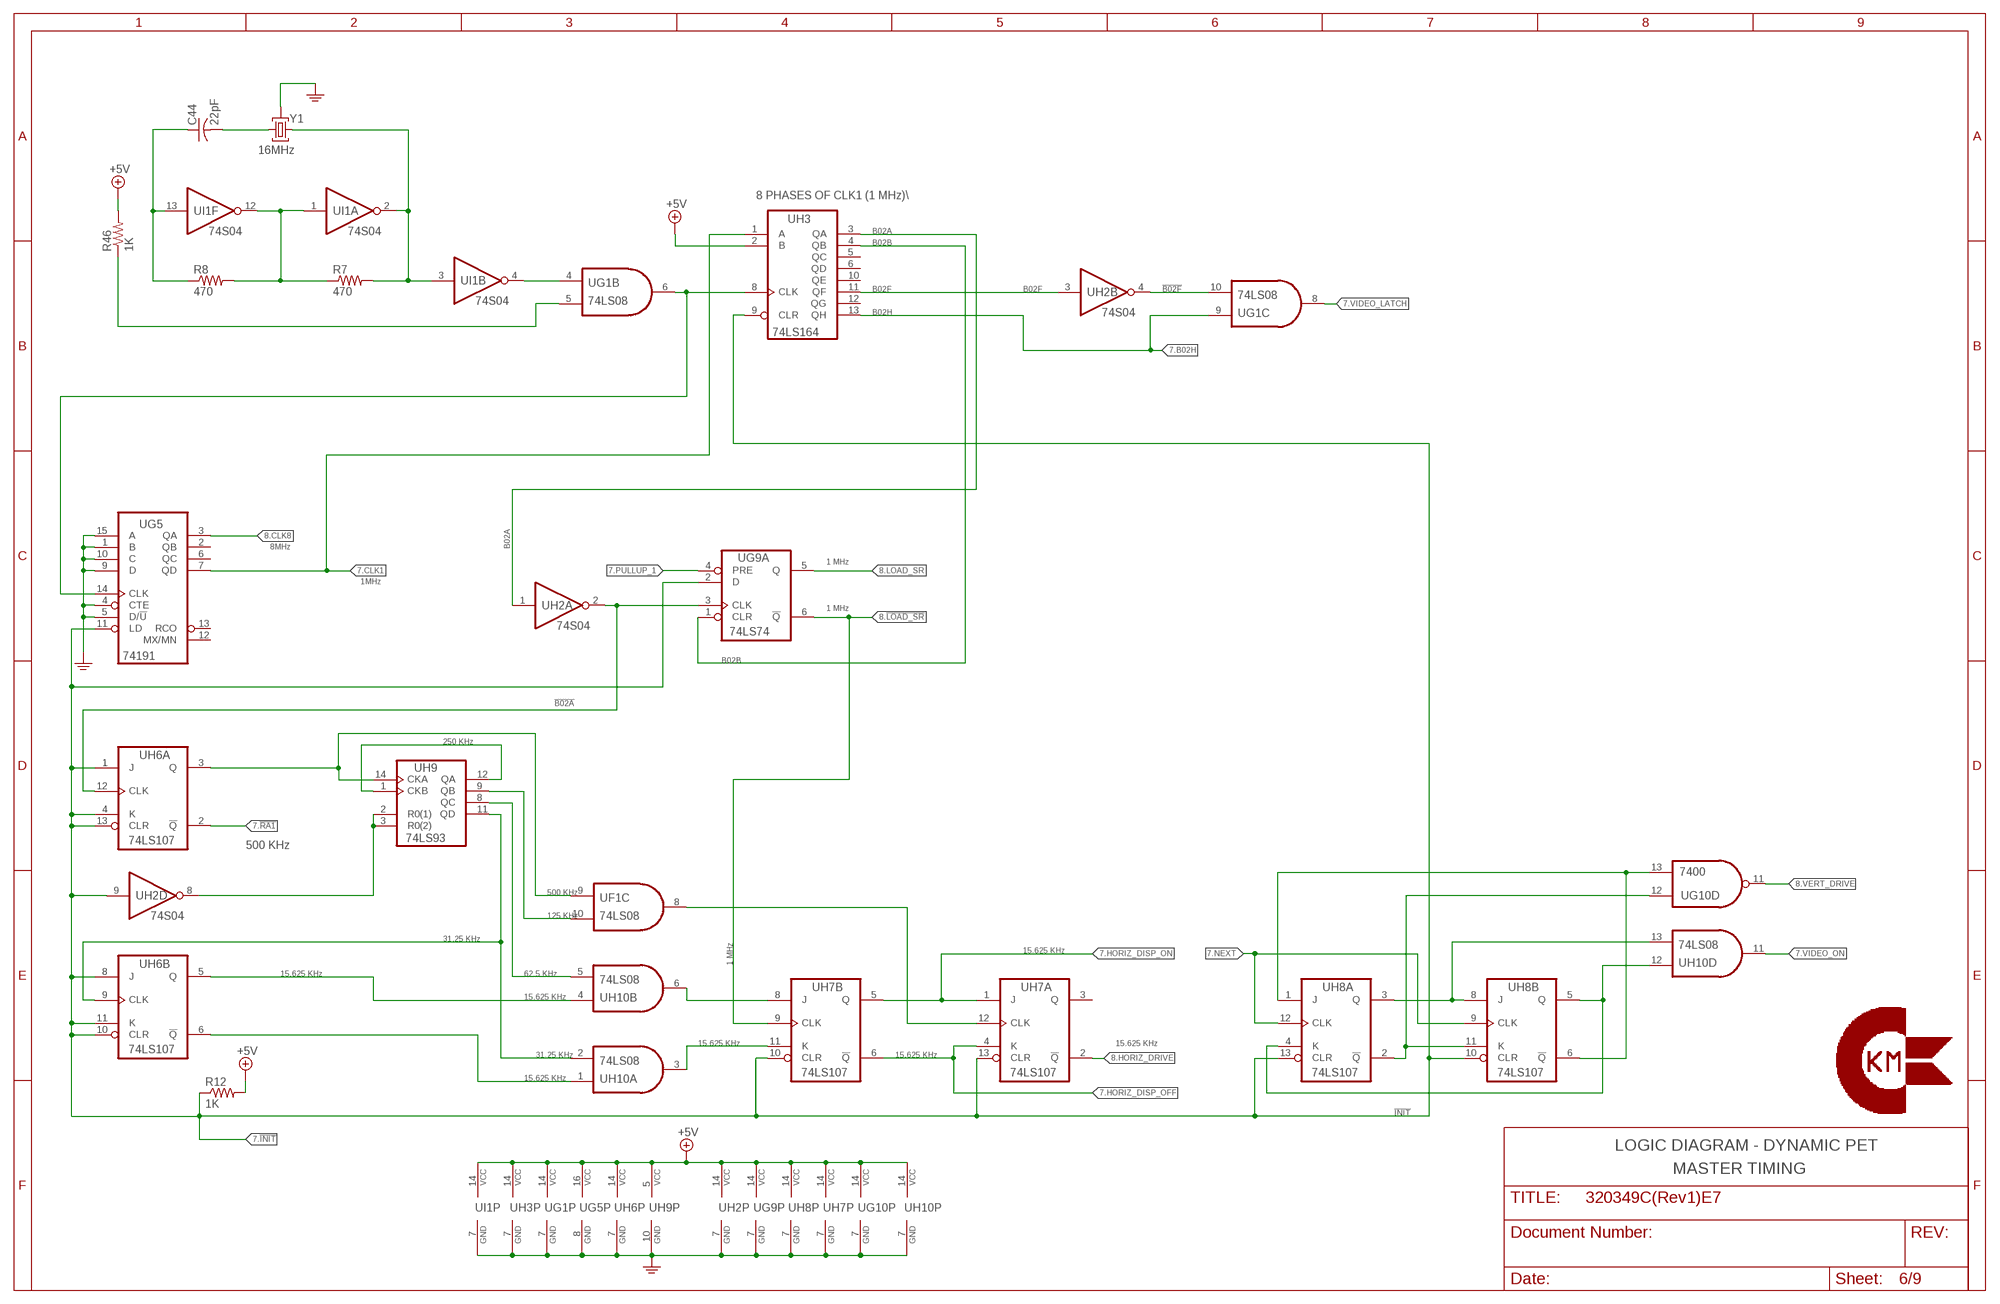
[diagram p5: schematic, sheet 6]

### Parts
C44  22pF  C-US050-035X075  [C050-035X075]
R7  470  R-US_0207/10  [0207/10]
R8  470  R-US_0207/10  [0207/10]
R12  1K  R-US_0207/10  [0207/10]
R46  1K  R-US_0207/10  [0207/10]
UG5  74191  74191N  [DIL16]
UG9  74LS74  74LS74N  [DIL14]
UH3  74LS164  74LS164N  [DIL14]
UH6  74LS107  74LS107N  [DIL14]
UH7  74LS107  74LS107N  [DIL14]
UH8  74LS107  74LS107N  [DIL14]
UH9  74LS93  74LS93N  [DIL14]
UH10  74LS08  74LS08N  [DIL14]
Y1  16MHz  HC49TL-H  [HC49TL-H]

### Nets
!B02A: UG9.3(A:CLK) UH2.2(A:O) UH6.12(A:CLK)
!B02F: UG1.10(C:I1) UH2.4(B:O)
!INIT: R12.1 UG5.11(LD) UG9.2(A:D) UH2.9(D:I) UH3.9(CLR) UH6.1(A:J) UH6.4(A:K) UH6.8(B:J) UH6.10(B:CLR) UH6.11(B:K) UH6.13(A:CLR) UH7.10(B:CLR) UH7.13(A:CLR) UH8.10(B:CLR) UH8.13(A:CLR) ; also sheet 7,8
!LOAD_SR: UG9.6(A:!Q) UH7.9(B:CLK) ; also sheet 8
!RA1: UH6.2(A:!Q) ; also sheet 7
+5V: R12.2 R46.2 UG1.14(P:VCC) UG5.16(VCC) UG9.14(P:VCC) UG10.14(P:VCC) UH2.14(P:VCC) UH3.2(B) UH3.14(VCC) UH6.14(P:VCC) UH7.14(P:VCC) UH8.14(P:VCC) UH9.5(VCC) UH10.14(P:VCC) UI1.14(P:VCC) ; also sheet 1,2,3,4,5,7,8,9
B02A: UH2.1(A:I) UH3.3(QA)
B02B: UG9.1(A:CLR) UH3.4(QB)
B02F: UH2.3(B:I) UH3.11(QF)
B02H: UG1.9(C:I0) UH3.13(QH) ; also sheet 7
CLK1: UG5.7(QD) UH3.1(A) ; also sheet 1,7
CLK8: UG5.3(QA) ; also sheet 8
GND: UG1.7(P:GND) UG5.1(B) UG5.4(CTE) UG5.5(D/!U) UG5.8(GND) UG5.9(D) UG5.10(C) UG5.15(A) UG9.7(P:GND) UG10.7(P:GND) UH2.7(P:GND) UH3.7(GND) UH6.7(P:GND) UH7.7(P:GND) UH8.7(P:GND) UH9.10(GND) UH10.7(P:GND) UI1.7(P:GND) Y1.3 ; also sheet 1,2,3,4,5,7,8,9
HORIZ_DISP_OFF: UH7.4(A:K) UH7.6(B:!Q) ; also sheet 7
HORIZ_DISP_ON: UH7.1(A:J) UH7.5(B:Q) ; also sheet 7,8
HORIZ_DRIVE: UH7.2(A:!Q) ; also sheet 5,8
LOAD_SR: UG9.5(A:Q) ; also sheet 8
N$1: C44.2 Y1.2
N$2: C44.1 R8.1 UI1.13(F:I)
N$3: UG1.6(B:O) UG5.14(CLK) UH3.8(CLK)
N$5: R7.2 UI1.2(A:O) UI1.3(B:I) Y1.1
N$8: UG1.4(B:I0) UI1.4(B:O)
N$16: UH6.6(B:!Q) UH10.1(A:I0)
N$19: UF1.8(C:O) UH7.12(A:CLK)
N$20: UH2.8(D:O) UH9.2(R0(1)) UH9.3(R0(2))
N$22: UH7.11(B:K) UH10.3(A:O)
N$23: UH7.8(B:J) UH10.6(B:O)
N$25: UH8.3(A:Q) UH8.8(B:J) UH10.13(D:I1)
N$42: UG10.12(D:I0) UH8.2(A:!Q) UH8.11(B:K)
N$44: UH8.4(A:K) UH8.5(B:Q) UH10.12(D:I0)
N$46: UG10.13(D:I1) UH8.1(A:J) UH8.6(B:!Q)
NEXT: UH8.9(B:CLK) UH8.12(A:CLK) ; also sheet 7,8
PULLUP_1: UG9.4(A:PRE) ; also sheet 7,8
RA1: UF1.9(C:I0) UH6.3(A:Q) UH9.14(CKA)
RA2: UH9.1(CKB) UH9.12(QA)
RA3: UF1.10(C:I1) UH9.9(QB)
RA4: UH9.8(QC) UH10.5(B:I1)
RA5: UH6.9(B:CLK) UH9.11(QD) UH10.2(A:I1)
RA6: UH6.5(B:Q) UH10.4(B:I0)
TP8: R46.1 UG1.5(B:I1)
TP9: R7.1 R8.2 UI1.1(A:I) UI1.12(F:O)
VERT_DRIVE: UG10.11(D:O) ; also sheet 5,8
VIDEO_LATCH: UG1.8(C:O) ; also sheet 7,8
VIDEO_ON: UH10.11(D:O) ; also sheet 3,7,8
Unconnected: UG5.2(QB) UG5.6(QC) UG5.12(MX/MN) UG5.13(RCO) UH3.5(QC) UH3.6(QD) UH3.10(QE) UH3.12(QG) UH7.3(A:Q)

### Notes on the sheet
- 8 PHASES OF CLK1 (1 MHz)\
- 8MHz
- 1 MHz
- 1MHz
- 1 MHz
- 250 KHz
- 500 KHz
- 500 KHz
- 125 KHz
- 31.25 KHz
- 15.625 KHz
- 1 MHz
- 15.625 KHz | 62.5 KHz
- 15.625 KHz
- 15.625 KHz | 15.625 KHz
- 31.25 KHz | 15.625 KHz
- 15.625 KHz
- LOGIC DIAGRAM - DYNAMIC PET
- MASTER TIMING

## Sheet 7 of 9
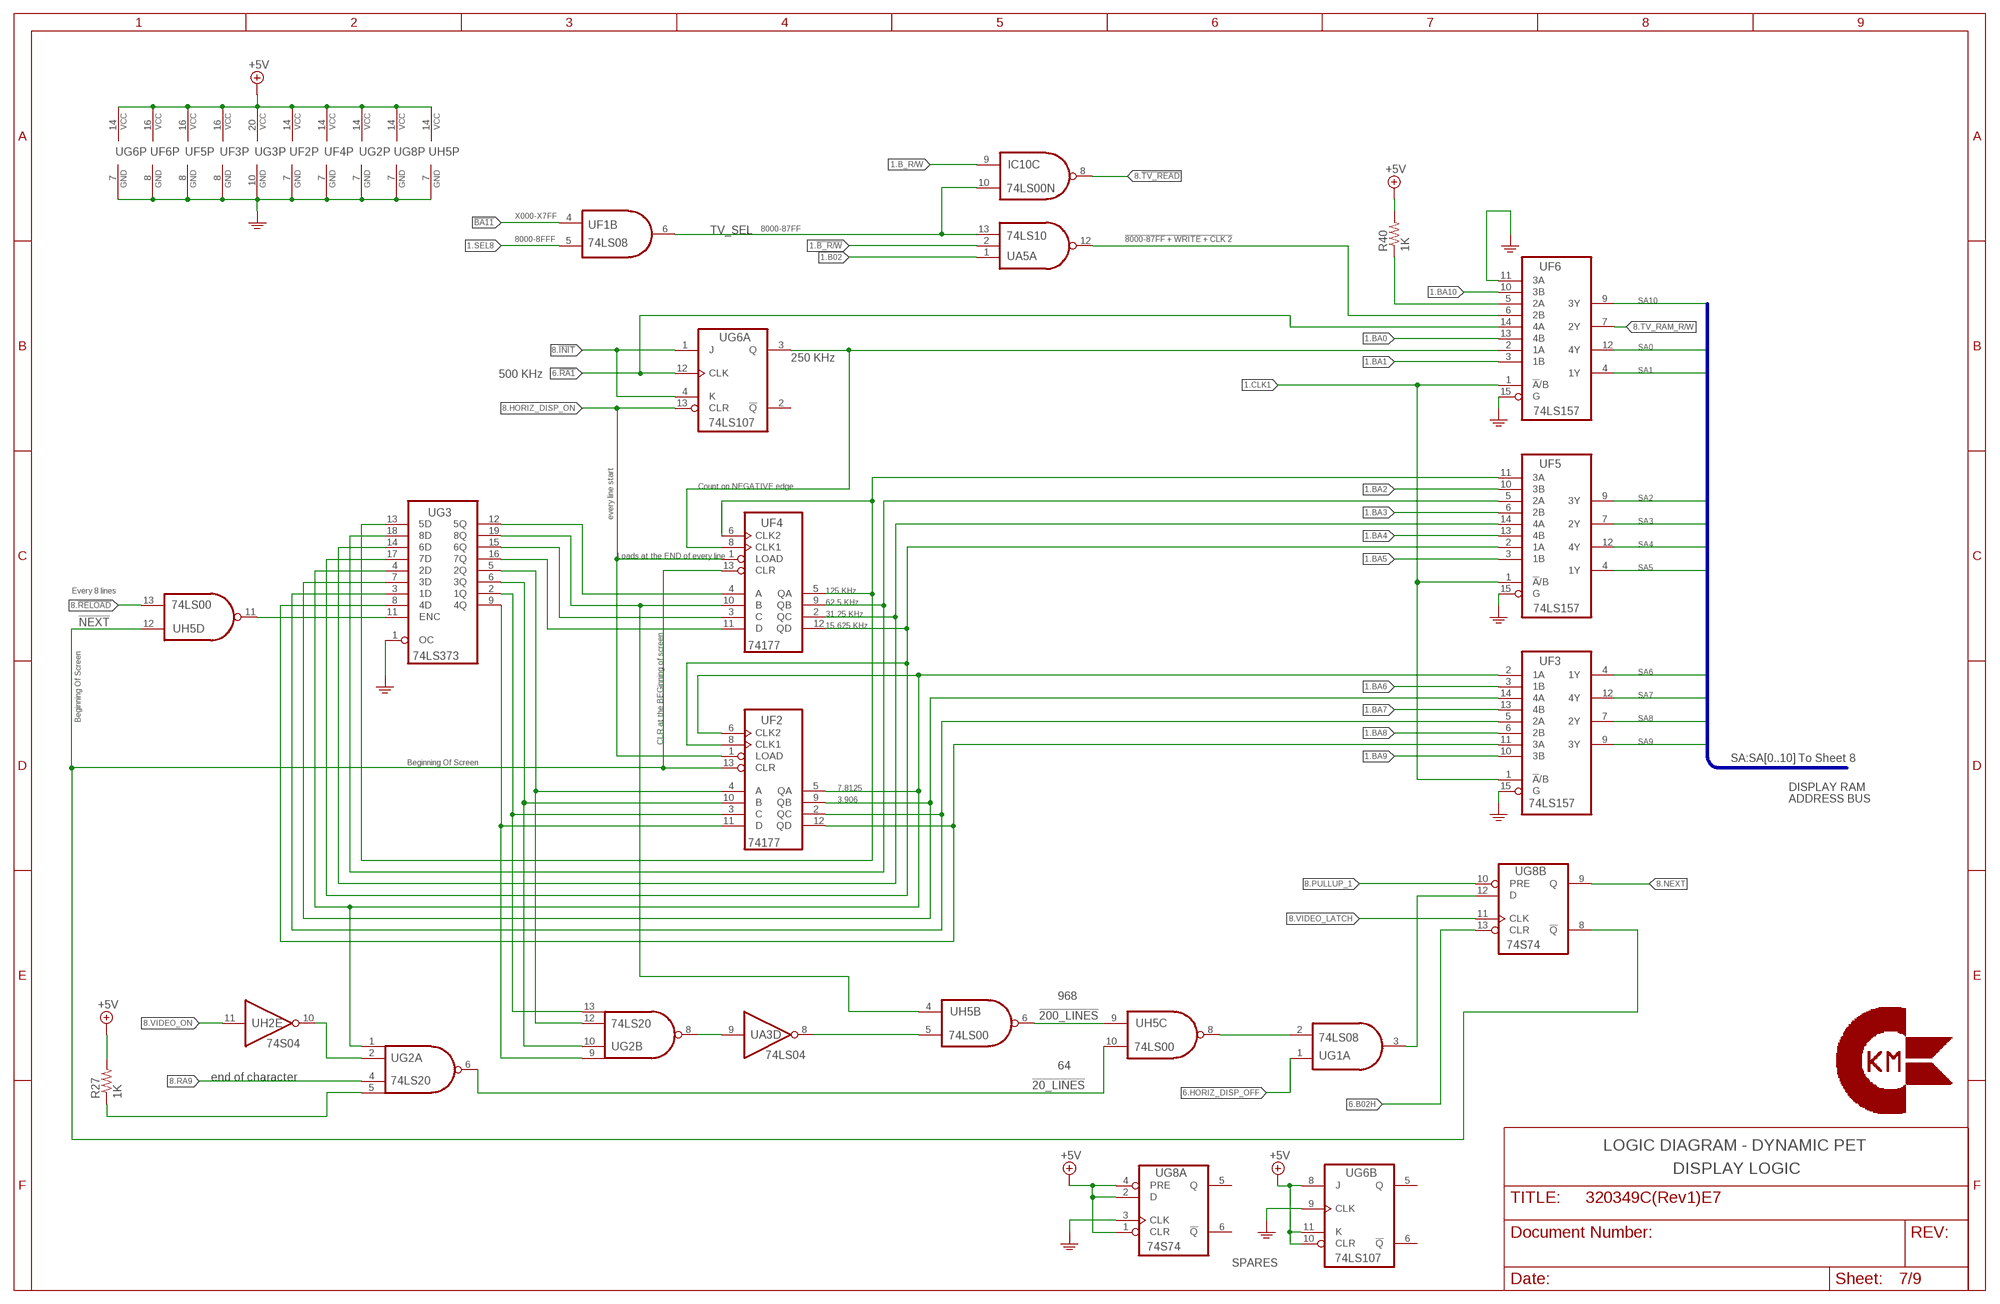
[diagram p6: schematic, sheet 7]

### Parts
R27  1K  R-US_0207/10  [0207/10]
R40  1K  R-US_0207/10  [0207/10]
UF2  74177  74177N  [DIL14]
UF3  74LS157  74LS157CN  [DIL16]
UF4  74177  74177N  [DIL14]
UF5  74LS157  74LS157BN  [DIL16]
UF6  74LS157  74LS157BN  [DIL16]
UG2  74LS20  74LS20N  [DIL14]
UG3  74LS373  74LS373BN  [DIL20]
UG6  74LS107  74LS107N  [DIL14]
UG8  74S74  74S74N  [DIL14]

### Nets
!20_LINES: UG2.6(A:O) UH5.10(C:I1)
!200_LINES: UH5.6(B:O) UH5.9(C:I0)
!B_R/W: UA5.2(A:I1) ; also sheet 1
!BA11: UF1.4(B:I0) ; also sheet 1
!INIT: UG6.1(A:J) UG6.4(A:K) ; also sheet 6,8
!NEXT: UF2.13(CLR) UF4.13(CLR) UG8.8(B:!Q) UH5.12(D:I0)
!RA1: UF6.14(4A) UG6.12(A:CLK) ; also sheet 6
!RELOAD: UH5.13(D:I1) ; also sheet 8
!TV_READ: IC10.8(C:O) ; also sheet 8
+5V: R27.2 R40.2 UF2.14(VCC) UF3.16(VCC) UF4.14(VCC) UF5.16(VCC) UF6.16(VCC) UG2.14(P:VCC) UG3.20(VCC) UG6.8(B:J) UG6.10(B:CLR) UG6.11(B:K) UG6.14(P:VCC) UG8.1(A:CLR) UG8.2(A:D) UG8.4(A:PRE) UG8.14(P:VCC) UH5.14(P:VCC) ; also sheet 1,2,3,4,5,6,8,9
B02: UA5.1(A:I0) ; also sheet 1,2,3,5
B02H: UG8.13(B:CLR) ; also sheet 6
B_R/W: IC10.9(C:I0) ; also sheet 1,5
BA0: UF6.13(4B) ; also sheet 1,2,3,4,5
BA1: UF6.3(1B) ; also sheet 1,2,3,4,5
BA2: UF5.10(3B) ; also sheet 1,3,4,5
BA3: UF5.6(2B) ; also sheet 1,3,4,5
BA4: UF5.13(4B) ; also sheet 1,3,4,5
BA5: UF5.3(1B) ; also sheet 1,2,4,5
BA6: UF3.3(1B) ; also sheet 1,3,4,5
BA7: UF3.13(4B) ; also sheet 1,4,5
BA8: UF3.6(2B) ; also sheet 1,4,5
BA9: UF3.10(3B) ; also sheet 1,4,5
BA10: UF6.10(3B) ; also sheet 1,4,5
CLK1: UF3.1(!A!/B) UF5.1(!A!/B) UF6.1(!A!/B) ; also sheet 1,6
GND: UF2.7(GND) UF3.8(GND) UF3.15(G) UF4.7(GND) UF5.8(GND) UF5.15(G) UF6.8(GND) UF6.11(3A) UF6.15(G) UG2.7(P:GND) UG3.1(OC) UG3.10(GND) UG6.7(P:GND) UG6.9(B:CLK) UG8.3(A:CLK) UG8.7(P:GND) UH5.7(P:GND) ; also sheet 1,2,3,4,5,6,8,9
HORIZ_DISP_OFF: UG1.1(A:I0) ; also sheet 6
HORIZ_DISP_ON: UF2.1(LOAD) UF4.1(LOAD) UG6.13(A:CLR) ; also sheet 6,8
N$4: UF4.5(QA) UF4.6(CLK2) UF5.11(3A) UG3.13(5D)
N$11: UF4.9(QB) UF5.5(2A) UG3.18(8D)
N$12: UF4.2(QC) UF5.14(4A) UG3.14(6D)
N$13: UF2.8(CLK1) UF4.12(QD) UF5.2(1A) UG3.17(7D)
N$17: UF2.5(QA) UF2.6(CLK2) UF3.2(1A) UG2.1(A:I0) UG3.4(2D)
N$24: UF2.9(QB) UF3.14(4A) UG3.7(3D)
N$49: R40.1 UF6.5(2A)
N$56: UA5.12(A:O) UF6.6(2B)
N$59: UF4.8(CLK1) UF6.2(1A) UG6.3(A:Q)
N$60: UF2.2(QC) UF3.5(2A) UG3.3(1D)
N$64: UF2.12(QD) UF3.11(3A) UG3.8(4D)
N$65: UF2.11(D) UG2.9(B:I0) UG3.9(4Q)
N$66: UF2.3(C) UG2.13(B:I3) UG3.2(1Q)
N$67: UF2.10(B) UG2.10(B:I1) UG3.6(3Q)
N$68: UF2.4(A) UG2.12(B:I2) UG3.5(2Q)
N$69: UF4.11(D) UG3.16(7Q)
N$70: UF4.3(C) UG3.15(6Q)
N$71: UF4.10(B) UG3.19(8Q) UH5.4(B:I0)
N$72: UF4.4(A) UG3.12(5Q)
N$75: UG1.3(A:O) UG8.12(B:D)
N$77: UG1.2(A:I1) UH5.8(C:O)
N$81: UA3.8(D:O) UH5.5(B:I1)
N$82: UA3.9(D:I) UG2.8(B:O)
N$83: UG3.11(ENC) UH5.11(D:O)
N$84: UG2.2(A:I1) UH2.10(E:O)
NEXT: UG8.9(B:Q) ; also sheet 6,8
PULLUP_1: UG8.10(B:PRE) ; also sheet 6,8
PULLUP_2: R27.1 UG2.5(A:I3)
RA9: UG2.4(A:I2) ; also sheet 8
SA0: UF6.12(4Y) ; also sheet 8
SA1: UF6.4(1Y) ; also sheet 8
SA2: UF5.9(3Y) ; also sheet 8
SA3: UF5.7(2Y) ; also sheet 8
SA4: UF5.12(4Y) ; also sheet 8
SA5: UF5.4(1Y) ; also sheet 8
SA6: UF3.4(1Y) ; also sheet 8
SA7: UF3.12(4Y) ; also sheet 8
SA8: UF3.7(2Y) ; also sheet 8
SA9: UF3.9(3Y) ; also sheet 8
SA10: UF6.9(3Y) ; also sheet 8
SEL8: UF1.5(B:I1) ; also sheet 1,5
TV_RAM_R/W: UF6.7(2Y) ; also sheet 8
TV_SEL: IC10.10(C:I1) UA5.13(A:I2) UF1.6(B:O)
VIDEO_LATCH: UG8.11(B:CLK) ; also sheet 6,8
VIDEO_ON: UH2.11(E:I) ; also sheet 3,6,8
Unconnected: UG6.2(A:!Q) UG6.5(B:Q) UG6.6(B:!Q) UG8.5(A:Q) UG8.6(A:!Q)

### Buses
SA:SA[0..10]

### Notes on the sheet
- X000-X7FF
- 8000-87FF
- 8000-8FFF | !8000-87FF + WRITE + CLK 2
- 250 KHz
- 500 KHz
- Count on NEGATIVE edge
- every line start
- Loads at the END of every line
- Every 8 lines | 125 KHz
- 62.5 KHz
- 31.25 KHz
- 15.625 KHz
- Beginning Of Screen
- CLR at the BEGinning of screen
- To Sheet 8
- Beginning Of Screen
- 7.8125 | DISPLAY RAM
- 3.906 | ADDRESS BUS
- 968
- 64
- end of character
- LOGIC DIAGRAM - DYNAMIC PET
- DISPLAY LOGIC
- SPARES

## Sheet 8 of 9
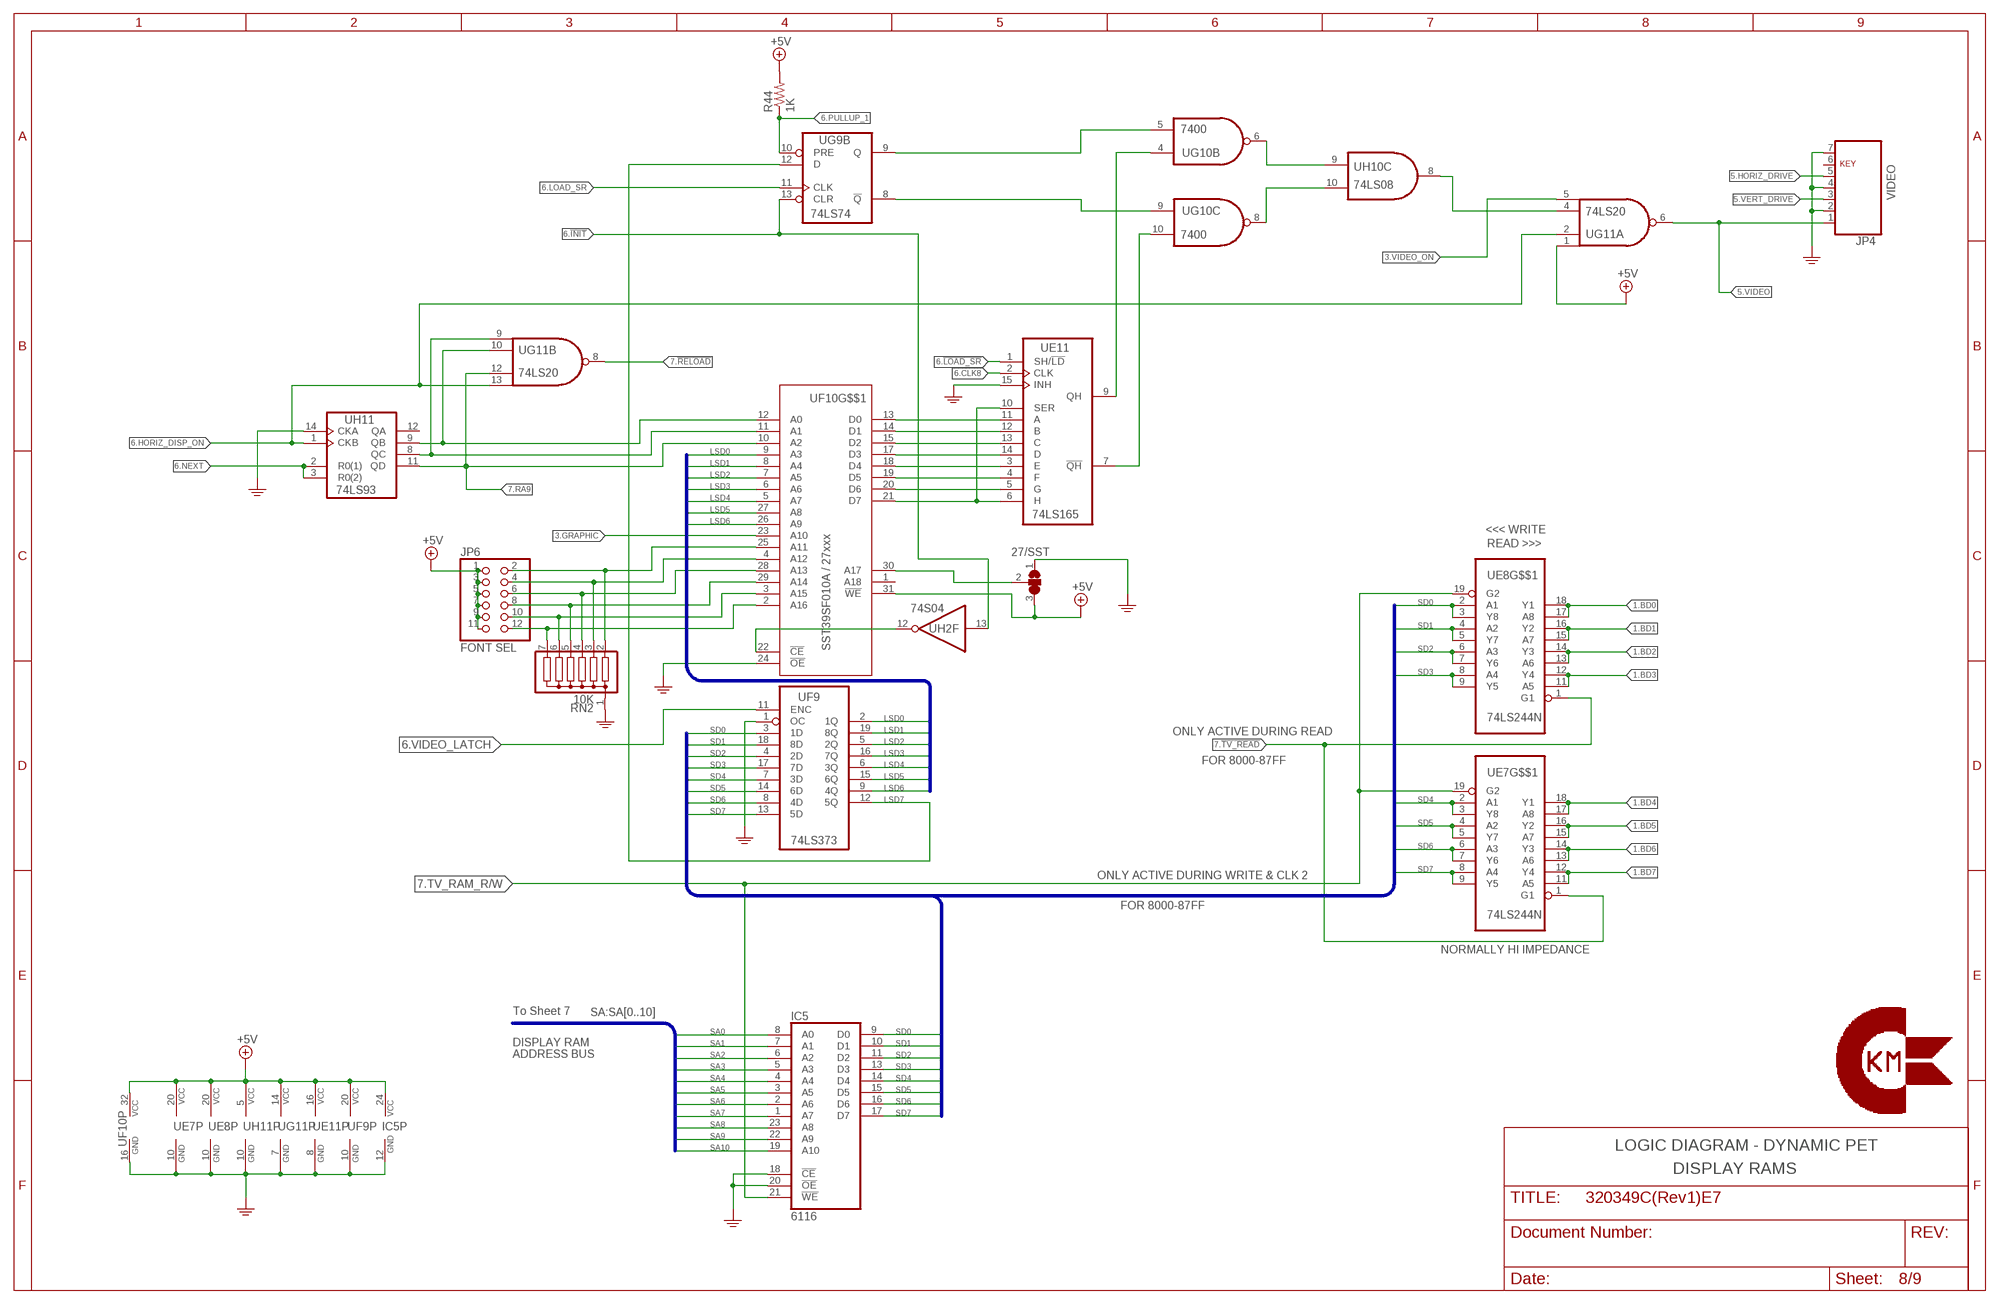
[diagram p7: schematic, sheet 8]

### Parts
IC5  6116  [DIL24]
JP4  VIDEO  PINHD-1X7  [1X07]
JP6  FONT SEL  PINHD-2X6  [2X06]
R44  1K  R-US_0207/10  [0207/10]
RN2  10K  G06R  [SIL7]
SJ1  27/SST  SJ2W  [SJ_2]
UE7  74LS244N  [DIL20]
UE8  74LS244N  [DIL20]
UE11  74LS165  74LS165N  [DIL16]
UF9  74LS373  74LS373CN  [DIL20]
UF10  SST39SF010A / 27xxx  SST39SF010A  [SST39SF010A]
UG11  74LS20  74LS20N  [DIL14]
UH11  74LS93  74LS93N  [DIL14]

### Nets
!INIT: UG9.13(B:CLR) UH2.13(F:I) ; also sheet 6,7
!LOAD_SR: UE11.1(SH/!LD) ; also sheet 6
!RELOAD: UG11.8(B:O) ; also sheet 7
!TV_READ: UE7.1(G1) UE8.1(G1) ; also sheet 7
+5V: IC5.24(VCC) JP6.1 JP6.3 JP6.5 JP6.7 JP6.9 JP6.11 R44.2 SJ1.3 UE7.20(VCC) UE8.20(VCC) UE11.16(VCC) UF9.20(VCC) UF10.31(G$$1:!WE) UF10.32(P:VCC) UG11.1(A:I0) UG11.14(P:VCC) UH11.5(VCC) ; also sheet 1,2,3,4,5,6,7,9
BD0: UE8.17(A8) UE8.18(Y1) ; also sheet 1
BD1: UE8.15(A7) UE8.16(Y2) ; also sheet 1
BD2: UE8.13(A6) UE8.14(Y3) ; also sheet 1
BD3: UE8.11(A5) UE8.12(Y4) ; also sheet 1
BD4: UE7.17(A8) UE7.18(Y1) ; also sheet 1
BD5: UE7.15(A7) UE7.16(Y2) ; also sheet 1
BD6: UE7.13(A6) UE7.14(Y3) ; also sheet 1
BD7: UE7.11(A5) UE7.12(Y4) ; also sheet 1
CLK8: UE11.2(CLK) ; also sheet 6
GND: IC5.12(GND) IC5.18(!CE) IC5.20(!OE) JP4.2 JP4.4 JP4.7 RN2.1 SJ1.1 UE7.10(GND) UE8.10(GND) UE11.8(GND) UE11.15(INH) UF9.1(OC) UF9.10(GND) UF10.16(P:GND) UF10.24(G$$1:!OE) UG11.7(P:GND) UH11.10(GND) UH11.14(CKA) ; also sheet 1,2,3,4,5,6,7,9
GRAPHIC: UF10.23(G$$1:A10) ; also sheet 3
HORIZ_DISP_ON: UG11.2(A:I1) UG11.13(B:I3) UH11.1(CKB) ; also sheet 6,7
HORIZ_DRIVE: JP4.5 ; also sheet 5,6
LOAD_SR: UG9.11(B:CLK) ; also sheet 6
LSD0: UF9.2(1Q) UF10.9(G$$1:A3)
LSD1: UF9.19(8Q) UF10.8(G$$1:A4)
LSD2: UF9.5(2Q) UF10.7(G$$1:A5)
LSD3: UF9.16(7Q) UF10.6(G$$1:A6)
LSD4: UF9.6(3Q) UF10.5(G$$1:A7)
LSD5: UF9.15(6Q) UF10.27(G$$1:A8)
LSD6: UF9.9(4Q) UF10.26(G$$1:A9)
LSD7: UF9.12(5Q) UG9.12(B:D)
N$53: UF10.22(G$$1:!CE) UH2.12(F:O)
N$54: JP6.2 RN2.2 UF10.25(G$$1:A11)
N$55: JP6.4 RN2.3 UF10.4(G$$1:A12)
N$57: JP6.6 RN2.4 UF10.28(G$$1:A13)
N$58: JP6.8 RN2.5 UF10.29(G$$1:A14)
N$61: UF10.11(G$$1:A1) UG11.9(B:I0) UH11.8(QC)
N$62: JP6.10 RN2.6 UF10.3(G$$1:A15)
N$63: JP6.12 RN2.7 UF10.2(G$$1:A16)
N$73: SJ1.2 UF10.30(G$$1:A17)
N$78: UG11.4(A:I2) UH10.8(C:O)
N$86: UG9.9(B:Q) UG10.5(B:I1)
N$87: UG9.8(B:!Q) UG10.9(C:I0)
N$88: UG10.8(C:O) UH10.10(C:I1)
N$96: UG10.6(B:O) UH10.9(C:I0)
N$99: UE11.7(!QH) UG10.10(C:I1)
N$102: UE11.9(QH) UG10.4(B:I0)
N$104: UE11.11(A) UF10.13(G$$1:D0)
N$109: UE11.12(B) UF10.14(G$$1:D1)
N$111: UE11.13(C) UF10.15(G$$1:D2)
N$112: UE11.14(D) UF10.17(G$$1:D3)
N$113: UE11.3(E) UF10.18(G$$1:D4)
N$124: UE11.4(F) UF10.19(G$$1:D5)
N$125: UE11.5(G) UF10.20(G$$1:D6)
N$126: UE11.6(H) UE11.10(SER) UF10.21(G$$1:D7)
NEXT: UH11.2(R0(1)) UH11.3(R0(2)) ; also sheet 6,7
PULLUP_1: R44.1 UG9.10(B:PRE) ; also sheet 6,7
RA7: UF10.12(G$$1:A0) UG11.10(B:I1) UH11.9(QB)
RA9: UF10.10(G$$1:A2) UG11.12(B:I2) UH11.11(QD) ; also sheet 7
SA0: IC5.8(A0) ; also sheet 7
SA1: IC5.7(A1) ; also sheet 7
SA2: IC5.6(A2) ; also sheet 7
SA3: IC5.5(A3) ; also sheet 7
SA4: IC5.4(A4) ; also sheet 7
SA5: IC5.3(A5) ; also sheet 7
SA6: IC5.2(A6) ; also sheet 7
SA7: IC5.1(A7) ; also sheet 7
SA8: IC5.23(A8) ; also sheet 7
SA9: IC5.22(A9) ; also sheet 7
SA10: IC5.19(A10) ; also sheet 7
SD0: IC5.9(D0) UE8.2(A1) UE8.3(Y8) UF9.3(1D)
SD1: IC5.10(D1) UE8.4(A2) UE8.5(Y7) UF9.18(8D)
SD2: IC5.11(D2) UE8.6(A3) UE8.7(Y6) UF9.4(2D)
SD3: IC5.13(D3) UE8.8(A4) UE8.9(Y5) UF9.17(7D)
SD4: IC5.14(D4) UE7.2(A1) UE7.3(Y8) UF9.7(3D)
SD5: IC5.15(D5) UE7.4(A2) UE7.5(Y7) UF9.14(6D)
SD6: IC5.16(D6) UE7.6(A3) UE7.7(Y6) UF9.8(4D)
SD7: IC5.17(D7) UE7.8(A4) UE7.9(Y5) UF9.13(5D)
TV_RAM_R/W: IC5.21(!WE) UE7.19(G2) UE8.19(G2) ; also sheet 7
VERT_DRIVE: JP4.3 ; also sheet 5,6
VIDEO: JP4.1 UG11.6(A:O) ; also sheet 5
VIDEO_LATCH: UF9.11(ENC) ; also sheet 6,7
VIDEO_ON: UG11.5(A:I3) ; also sheet 3,6,7
Unconnected: JP4.6 UF10.1(G$$1:A18) UH11.12(QA)

### Buses
LSD:LSD[0..6]
SD:SD[0..7]
SA:SA[0..10]

### Notes on the sheet
- KEY
- <<< WRITE
- READ >>>
- ONLY ACTIVE DURING READ
- FOR 8000-87FF
- ONLY ACTIVE DURING WRITE & CLK 2
- FOR 8000-87FF
- NORMALLY HI IMPEDANCE
- To Sheet 7
- DISPLAY RAM
- ADDRESS BUS
- LOGIC DIAGRAM - DYNAMIC PET
- DISPLAY RAMS

## Sheet 9 of 9
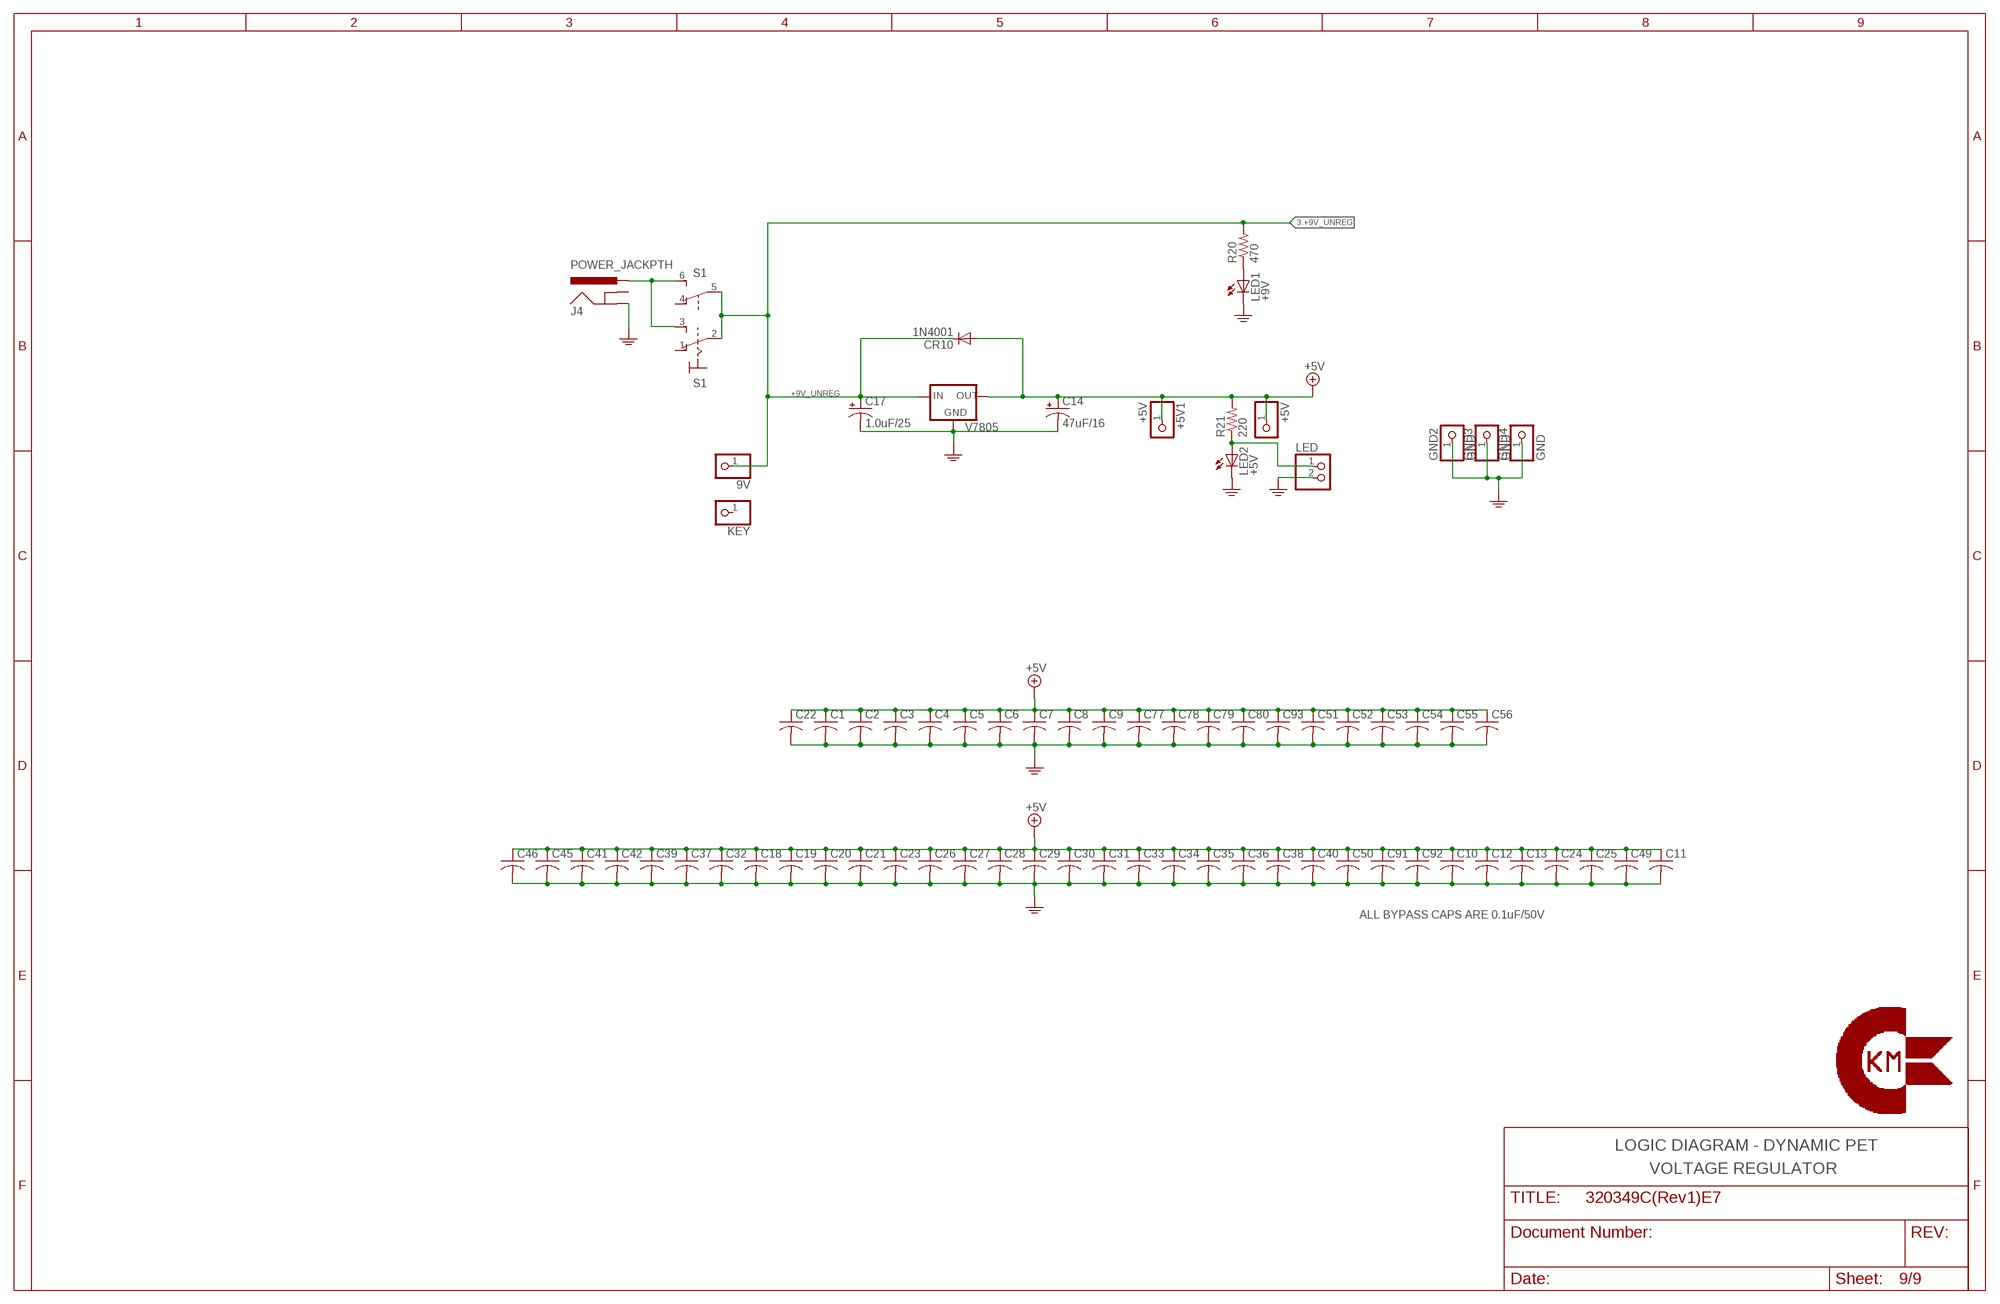
[diagram p8: schematic, sheet 9]

### Parts
9V  PINHD-1X1  [1X01]
+5V  PINHD-1X1  [1X01]
+5V1  +5V  PINHD-1X1  [1X01]
C1  0.1uF/50  C-US025-025X050  [C025-025X050]
C2  0.1uF/50  C-US025-025X050  [C025-025X050]
C3  0.1uF/50  C-US025-025X050  [C025-025X050]
C4  0.1uF/50  C-US025-025X050  [C025-025X050]
C5  0.1uF/50  C-US025-025X050  [C025-025X050]
C6  0.1uF/50  C-US025-025X050  [C025-025X050]
C7  0.1uF/50  C-US025-025X050  [C025-025X050]
C8  0.1uF/50  C-US025-025X050  [C025-025X050]
C9  0.1uF/50  C-US025-025X050  [C025-025X050]
C10  0.1uF/50  C-US025-025X050  [C025-025X050]
C11  0.1uF/50  C-US025-025X050  [C025-025X050]
C12  0.1uF/50  C-US025-025X050  [C025-025X050]
C13  0.1uF/50  C-US025-025X050  [C025-025X050]
C14  47uF/16  CPOL-USE2.5-6  [E2,5-6]
C17  1.0uF/25  CPOL-USE1.8-4  [E1,8-4]
C18  0.1uF/50  C-US025-025X050  [C025-025X050]
C19  0.1uF/50  C-US025-025X050  [C025-025X050]
C20  0.1uF/50  C-US025-025X050  [C025-025X050]
C21  0.1uF/50  C-US025-025X050  [C025-025X050]
C22  0.1uF/50  C-US025-025X050  [C025-025X050]
C23  0.1uF/50  C-US025-025X050  [C025-025X050]
C24  0.1uF/50  C-US025-025X050  [C025-025X050]
C25  0.1uF/50  C-US025-025X050  [C025-025X050]
C26  0.1uF/50  C-US025-025X050  [C025-025X050]
C27  0.1uF/50  C-US025-025X050  [C025-025X050]
C28  0.1uF/50  C-US025-025X050  [C025-025X050]
C29  0.1uF/50  C-US025-025X050  [C025-025X050]
C30  0.1uF/50  C-US025-025X050  [C025-025X050]
C31  0.1uF/50  C-US025-025X050  [C025-025X050]
C32  0.1uF/50  C-US025-025X050  [C025-025X050]
C33  0.1uF/50  C-US025-025X050  [C025-025X050]
C34  0.1uF/50  C-US025-025X050  [C025-025X050]
C35  0.1uF/50  C-US025-025X050  [C025-025X050]
C36  0.1uF/50  C-US025-025X050  [C025-025X050]
C37  0.1uF/50  C-US025-025X050  [C025-025X050]
C38  0.1uF/50  C-US025-025X050  [C025-025X050]
C39  0.1uF/50  C-US025-025X050  [C025-025X050]
C40  0.1uF/50  C-US025-025X050  [C025-025X050]
C41  0.1uF/50  C-US025-025X050  [C025-025X050]
C42  0.1uF/50  C-US025-025X050  [C025-025X050]
C45  0.1uF/50  C-US025-025X050  [C025-025X050]
C46  0.1uF/50  C-US025-025X050  [C025-025X050]
C49  0.1uF/50  C-US025-025X050  [C025-025X050]
C50  0.1uF/50  C-US025-025X050  [C025-025X050]
C51  0.1uF/50  C-US025-025X050  [C025-025X050]
C52  0.1uF/50  C-US025-025X050  [C025-025X050]
C53  0.1uF/50  C-US025-025X050  [C025-025X050]
C54  0.1uF/50  C-US025-025X050  [C025-025X050]
C55  0.1uF/50  C-US025-025X050  [C025-025X050]
C56  0.1uF/50  C-US025-025X050  [C025-025X050]
C77  0.1uF/50  C-US025-025X050  [C025-025X050]
C78  0.1uF/50  C-US025-025X050  [C025-025X050]
C79  0.1uF/50  C-US025-025X050  [C025-025X050]
C80  0.1uF/50  C-US025-025X050  [C025-025X050]
C91  0.1uF/50  C-US025-025X050  [C025-025X050]
C92  0.1uF/50  C-US025-025X050  [C025-025X050]
C93  0.1uF/50  C-US025-025X050  [C025-025X050]
CR10  1N4001  1N4004  [DO41-10]
GND2  GND  PINHD-1X1  [1X01]
GND3  GND  PINHD-1X1  [1X01]
GND4  GND  PINHD-1X1  [1X01]
J4  POWER_JACKPTH  [POWER_JACK_PTH]
KEY  Key  PINHD-1X1  [1X01]
LED  PINHD-1X2  [1X02]
LED1  +9V  LED5MM  [LED5MM]
LED2  +5V  LED5MM  [LED5MM]
R20  470  R-US_0207/10  [0207/10]
R21  220  R-US_0207/10  [0207/10]
S1  320-938  [320-938H]
V7805  VREG_78XXL  [VREG_78XXL]

### Nets
+5V: +5V1.1 +5V.1 C1.1 C2.1 C3.1 C4.1 C5.1 C6.1 C7.1 C8.1 C9.1 C10.1 C11.1 C12.1 C13.1 C14.+ C18.1 C19.1 C20.1 C21.1 C22.1 C23.1 C24.1 C25.1 C26.1 C27.1 C28.1 C29.1 C30.1 C31.1 C32.1 C33.1 C34.1 C35.1 C36.1 C37.1 C38.1 C39.1 C40.1 C41.1 C42.1 C45.1 C46.1 C49.1 C50.1 C51.1 C52.1 C53.1 C54.1 C55.1 C56.1 C77.1 C78.1 C79.1 C80.1 C91.1 C92.1 C93.1 CR10.A R21.2 V7805.OUT ; also sheet 1,2,3,4,5,6,7,8
+9V_UNREG: 9V.1 C17.+ CR10.C R20.2 S1.2(1:P) S1.5(B:P) V7805.IN ; also sheet 3
GND: C1.2 C2.2 C3.2 C4.2 C5.2 C6.2 C7.2 C8.2 C9.2 C10.2 C11.2 C12.2 C13.2 C14.- C17.- C18.2 C19.2 C20.2 C21.2 C22.2 C23.2 C24.2 C25.2 C26.2 C27.2 C28.2 C29.2 C30.2 C31.2 C32.2 C33.2 C34.2 C35.2 C36.2 C37.2 C38.2 C39.2 C40.2 C41.2 C42.2 C45.2 C46.2 C49.2 C50.2 C51.2 C52.2 C53.2 C54.2 C55.2 C56.2 C77.2 C78.2 C79.2 C80.2 C91.2 C92.2 C93.2 GND2.1 GND3.1 GND4.1 J4.GND LED1.K(C) LED2.K(C) LED.2 V7805.GND ; also sheet 1,2,3,4,5,6,7,8
N$38: LED1.A R20.1
N$41: LED2.A LED.1 R21.1
N$80: J4.PWR S1.3(1:S) S1.6(B:S)
Unconnected: J4.GNDBREAK KEY.1 S1.1(1:O) S1.4(B:O)

### Notes on the sheet
- ALL BYPASS CAPS ARE 0.1uF/50V
- LOGIC DIAGRAM - DYNAMIC PET
- VOLTAGE REGULATOR

## Library data of the parts
9V !HORIZ !VERT !VIDEO +5V +5V1 GND2-GND4 HGND HORIZ KEY SP1 SP2 TV-H TV-V VDGND VERT VGND VID VIDEO = 320349:PINHD-1X1: PIN HEADER
27/SST SJ1 = 320349:SJ2W: SMD solder JUMPER
C1-C13 C18-C42 C44-C56 C66 C68 C70 C77-C80 C91-C93 = 320349:C-US: CAPACITOR, American symbol
C14 C17 = rcl:CPOL-US: POLARIZED CAPACITOR, American symbol
C67 = 320349:CPOL-US: POLARIZED CAPACITOR, American symbol
CR10 D1 = 320349:1N4004: DIODE general purpose rectifier, 1 A
IC1 UA10 = 320349:74*17: Hex INVERTER, open collector, high-voltage
IC2 IC10 UA4 UG10 UH5 = 320349:74*00: Quad 2-input NAND gate
IC3 UF10 = 320349:SST39SF010A
IC4 IC9 = 320349:62256
IC5 = 320349:6116: 2K*8 SRAM
IC6 = 320349:74*02: Quad 2-input NOR gate
IC7 = 320349:74*645: Octal BUS TRANSCEIVER, open collector
J1 = 320349:IEEE-EDGE: IEEE connector for various Commodore computers, PET/CBM type, edge version
J2 = 320349:CBM_USERPORT-EDGE
J3 = 320349:CASETTE_EDGE
J4 VIDEO_OUT = 320349:POWER_JACK: Power Jack This is the standard 5.5mm barrel jack for power. The PTH is the most common, proven, reliable, footprint. All others are experimental. The Slot footprint only works if the mill layer is transmitted to the PCB fab house so be warned. Spark Fun Electronics SKU : PRT-00119. Mating wall wart : TOL-00298 (and others)
J5 = 320349:PET_KEYBOARD: PIN HEADER
JP1-JP3 JP5 = 320349:PINHD-1X3: PIN HEADER
JP4 = 320349:PINHD-1X7: PIN HEADER
JP6 = 320349:PINHD-2X6: PIN HEADER
LED RESET = 320349:PINHD-1X2: PIN HEADER
LED1 LED2 = 320349:LED: LED OSRAM: - CHIPLED LG R971, LG N971, LY N971, LG Q971, LY Q971, LO R971, LY R971 LH N974, LH R974 LS Q976, LO Q976, LY Q976 LO Q996 - Hyper CHIPLED LW Q18S LB Q993, LB Q99A, LB R99A - SideLED LS A670, LO A670, LY A670, LG A670, LP A670 LB A673, LV A673, LT A673, LW A673 LH A674 LY A675 LS A676, LA A676, LO A676, LY A676, LW A676 LS A679, LY A679, LG A679 - Hyper Micro SIDELED® LS Y876, LA Y876, LO Y876, LY Y876 LT Y87S - SmartLED LW L88C, LW L88S LB L89C, LB L89S, LG L890 LS L89K, LO L89K, LY L89K LS L896, LA L896, LO L896, LY L896 - TOPLED LS T670, LO T670, LY T670, LG T670, LP T670 LSG T670, LSP T670, LSY T670, LOP T670, LYG T670 LG T671, LOG T671, LSG T671 LB T673, LV T673, LT T673, LW T673 LH T674 LS T676, LA T676, LO T676, LY T676, LB T676, LH T676, LSB T676, LW T676 LB T67C, LV T67C, LT T67C, LS T67K, LO T67K, LY T67K, LW E67C LS E67B, LA E67B, LO E67B, LY E67B, LB E67C, LV E67C, LT E67C LW T67C LS T679, LY T679, LG T679 LS T770, LO T770, LY T770, LG T770, LP T770 LB T773, LV T773, LT T773, LW T773 LH T774 LS E675, LA E675, LY E675, LS T675 LS T776, LA T776, LO T776, LY T776, LB T776 LHGB T686 LT T68C, LB T68C - Hyper Mini TOPLED® LB M676 - Mini TOPLED Santana® LG M470 LS M47K, LO M47K, LY M47K Source: http://www.osram.convergy.de LUXEON: - LUMILED® LXK2-PW12-R00, LXK2-PW12-S00, LXK2-PW14-U00, LXK2-PW14-V00 LXK2-PM12-R00, LXK2-PM12-S00, LXK2-PM14-U00 LXK2-PE12-Q00, LXK2-PE12-R00, LXK2-PE12-S00, LXK2-PE14-T00, LXK2-PE14-U00 LXK2-PB12-K00, LXK2-PB12-L00, LXK2-PB12-M00, LXK2-PB14-N00, LXK2-PB14-P00, LXK2-PB14-Q00 LXK2-PR12-L00, LXK2-PR12-M00, LXK2-PR14-Q00, LXK2-PR14-R00 LXK2-PD12-Q00, LXK2-PD12-R00, LXK2-PD12-S00 LXK2-PH12-R00, LXK2-PH12-S00 LXK2-PL12-P00, LXK2-PL12-Q00, LXK2-PL12-R00 Source: www.luxeon.com KINGBRIGHT: KA-3528ASYC Source: www.kingbright.com
Q4 = 320349:TIP29: NPN Transistor
Q5 = 320349:2N4401: NPN Transistor
Q6 = 320349:2N3904: NPN Transistor
R1-R21 R27-R30 R40 R44 R46-R48 R50-R52 R100-R102 = 320349:R-US_: RESISTOR, American symbol
RN1 = 320349:G08R: SIL RESISTOR
RN2 = 320349:G06R: SIL RESISTOR
S1 = 320349:320-938: TOGGLE SWITCH distributor RS Components
SG1 = 320349C:BUZZER: Buzzer 12mm Spark Fun Electronics SKU : Comp-Buzzer
SJ2-SJ4 = jumper:SJ: SMD solder JUMPER
U$32 = 320349:CBM-XL
UA2 = 320349:*555: TIMER
UA3 UH2 UI1 = 320349:74*04: Hex INVERTER
UA5 = 320349:74*10: Triple 3-input NAND gate
UA7-UA9 = 320349:MC3446: IEEE-driver
UB2 = 320349:74*25: Dual 4-input NOR gate, strobe
UB3 UC3 = 320349:74*244B
UC4 = 320349:6502
UC5 = 320349:6522
UC6 UC7 = 320349:6520: MICROCONTROLLER/MEMORY DEVICE
UC9 = 320349:74*145: BCD to decimal DECODER/DRIVER
UD2 = 320349:74*154: 4-line to 16-line data SELECTOR/MULTIPLEXER
UE7 UE8 = 320349:74*244: Octal BUFFER and LINE DRIVER, 3-state
UE11 = 320349:74*165: 8-bit parallel load SHIFT REGISTER
UF1 UG1 UH10 = 320349:74*08: Quad 2-input AND gate
UF2 UF4 = 320349:74*177
UF3 = 320349:74*157C: Quadruple 2-line to 1-line data SELECTOR/MULTIPLEXER
UF5 UF6 = 320349:74*157B: Quadruple 2-line to 1-line data SELECTOR/MULTIPLEXER
UF9 = 320349:74*373C: Octal D type transparent LATCH, edge triggered
UG2 UG11 = 320349:74*20: Dual 4-input NAND gate
UG3 = 320349:74*373B: Octal D type transparent LATCH, edge triggered
UG5 = 320349:74*191: Synchronous UP/DOWN COUNTER
UG6 UH6-UH8 = 320349:74*107: Dual J-K FLIP FLOP, clear
UG8 UG9 = 320349:74*74: Dual D type positive edge triggered FLIP FLOP, preset and clear
UH3 = 320349:74*164: 8-bit parallel out SHIFT REGISTER
UH9 UH11 = 320349:74*93: Decade, divide by twelve and binary COUNTER
V7805 = 320349:VREG_78XXL
VR2 = 320349:ZPY: Z DIODE 1 W
Y1 = 320349:HC49TL-H: CRYSTAL